# EAGLE schematic Hydra RX (EAGLE 9.0.1)
CNAME: Hydrometra 2018; CREVISION: 1.0; DESIGNER: Sergio Betancur
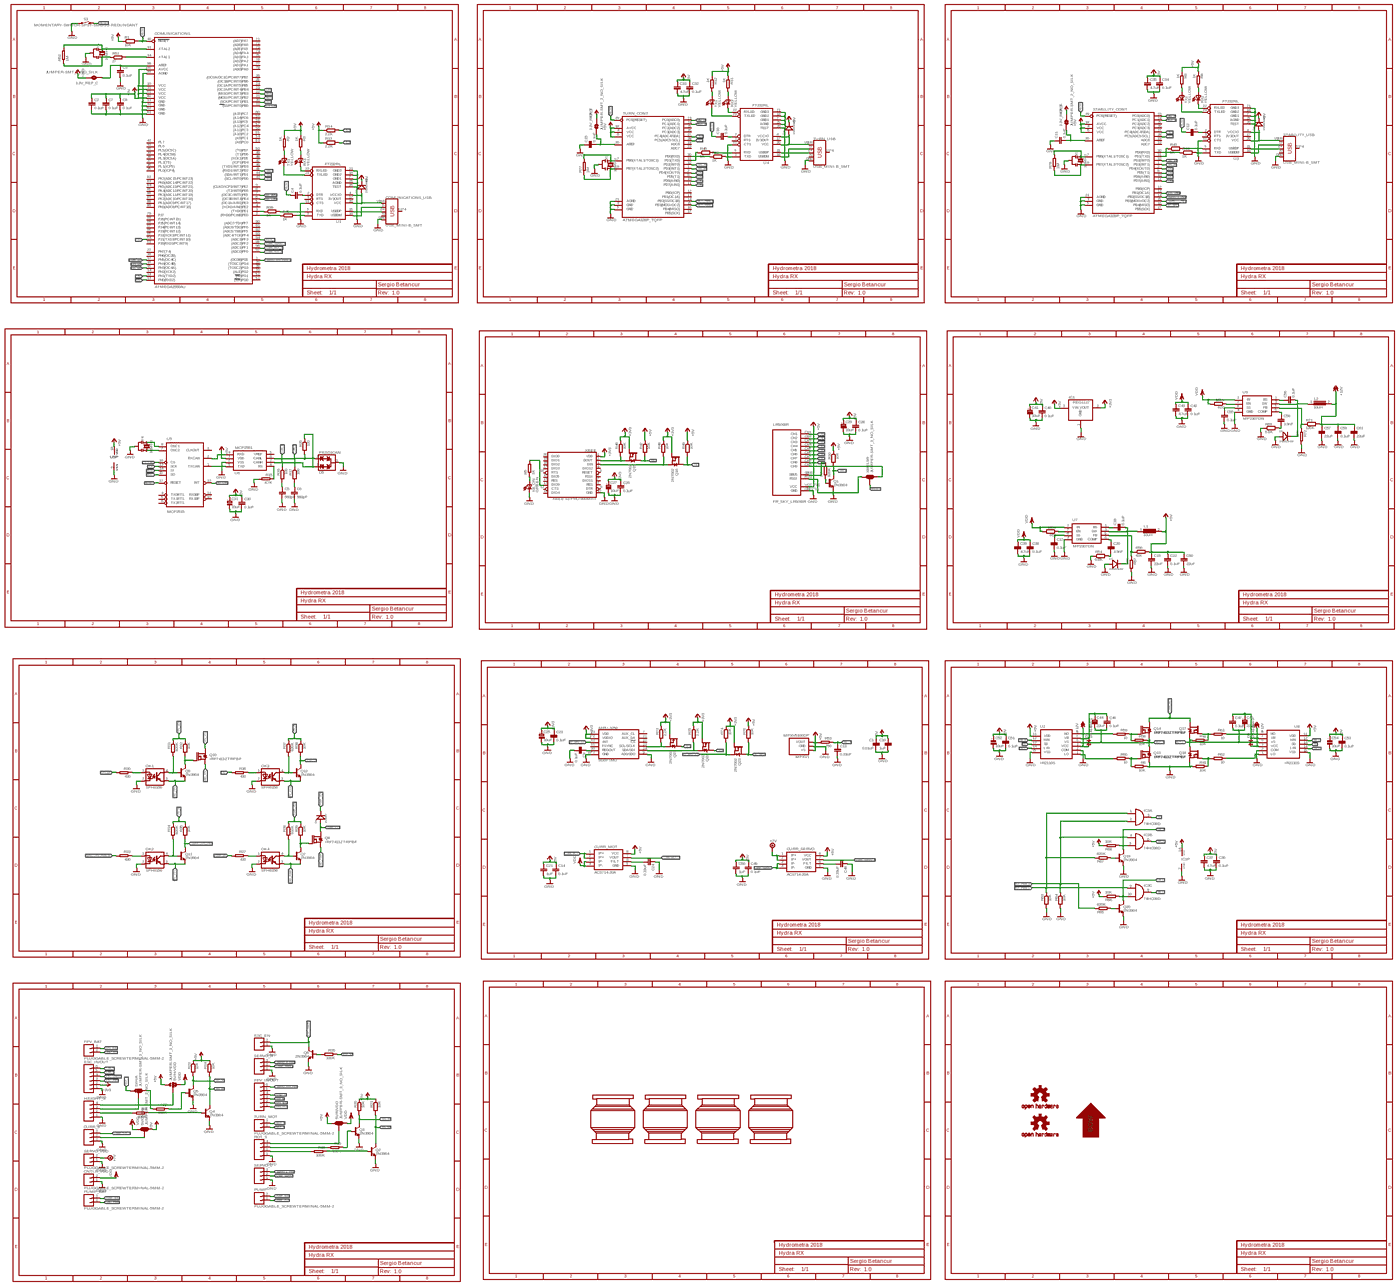
[diagram p0: schematic, sheet 1, overview]
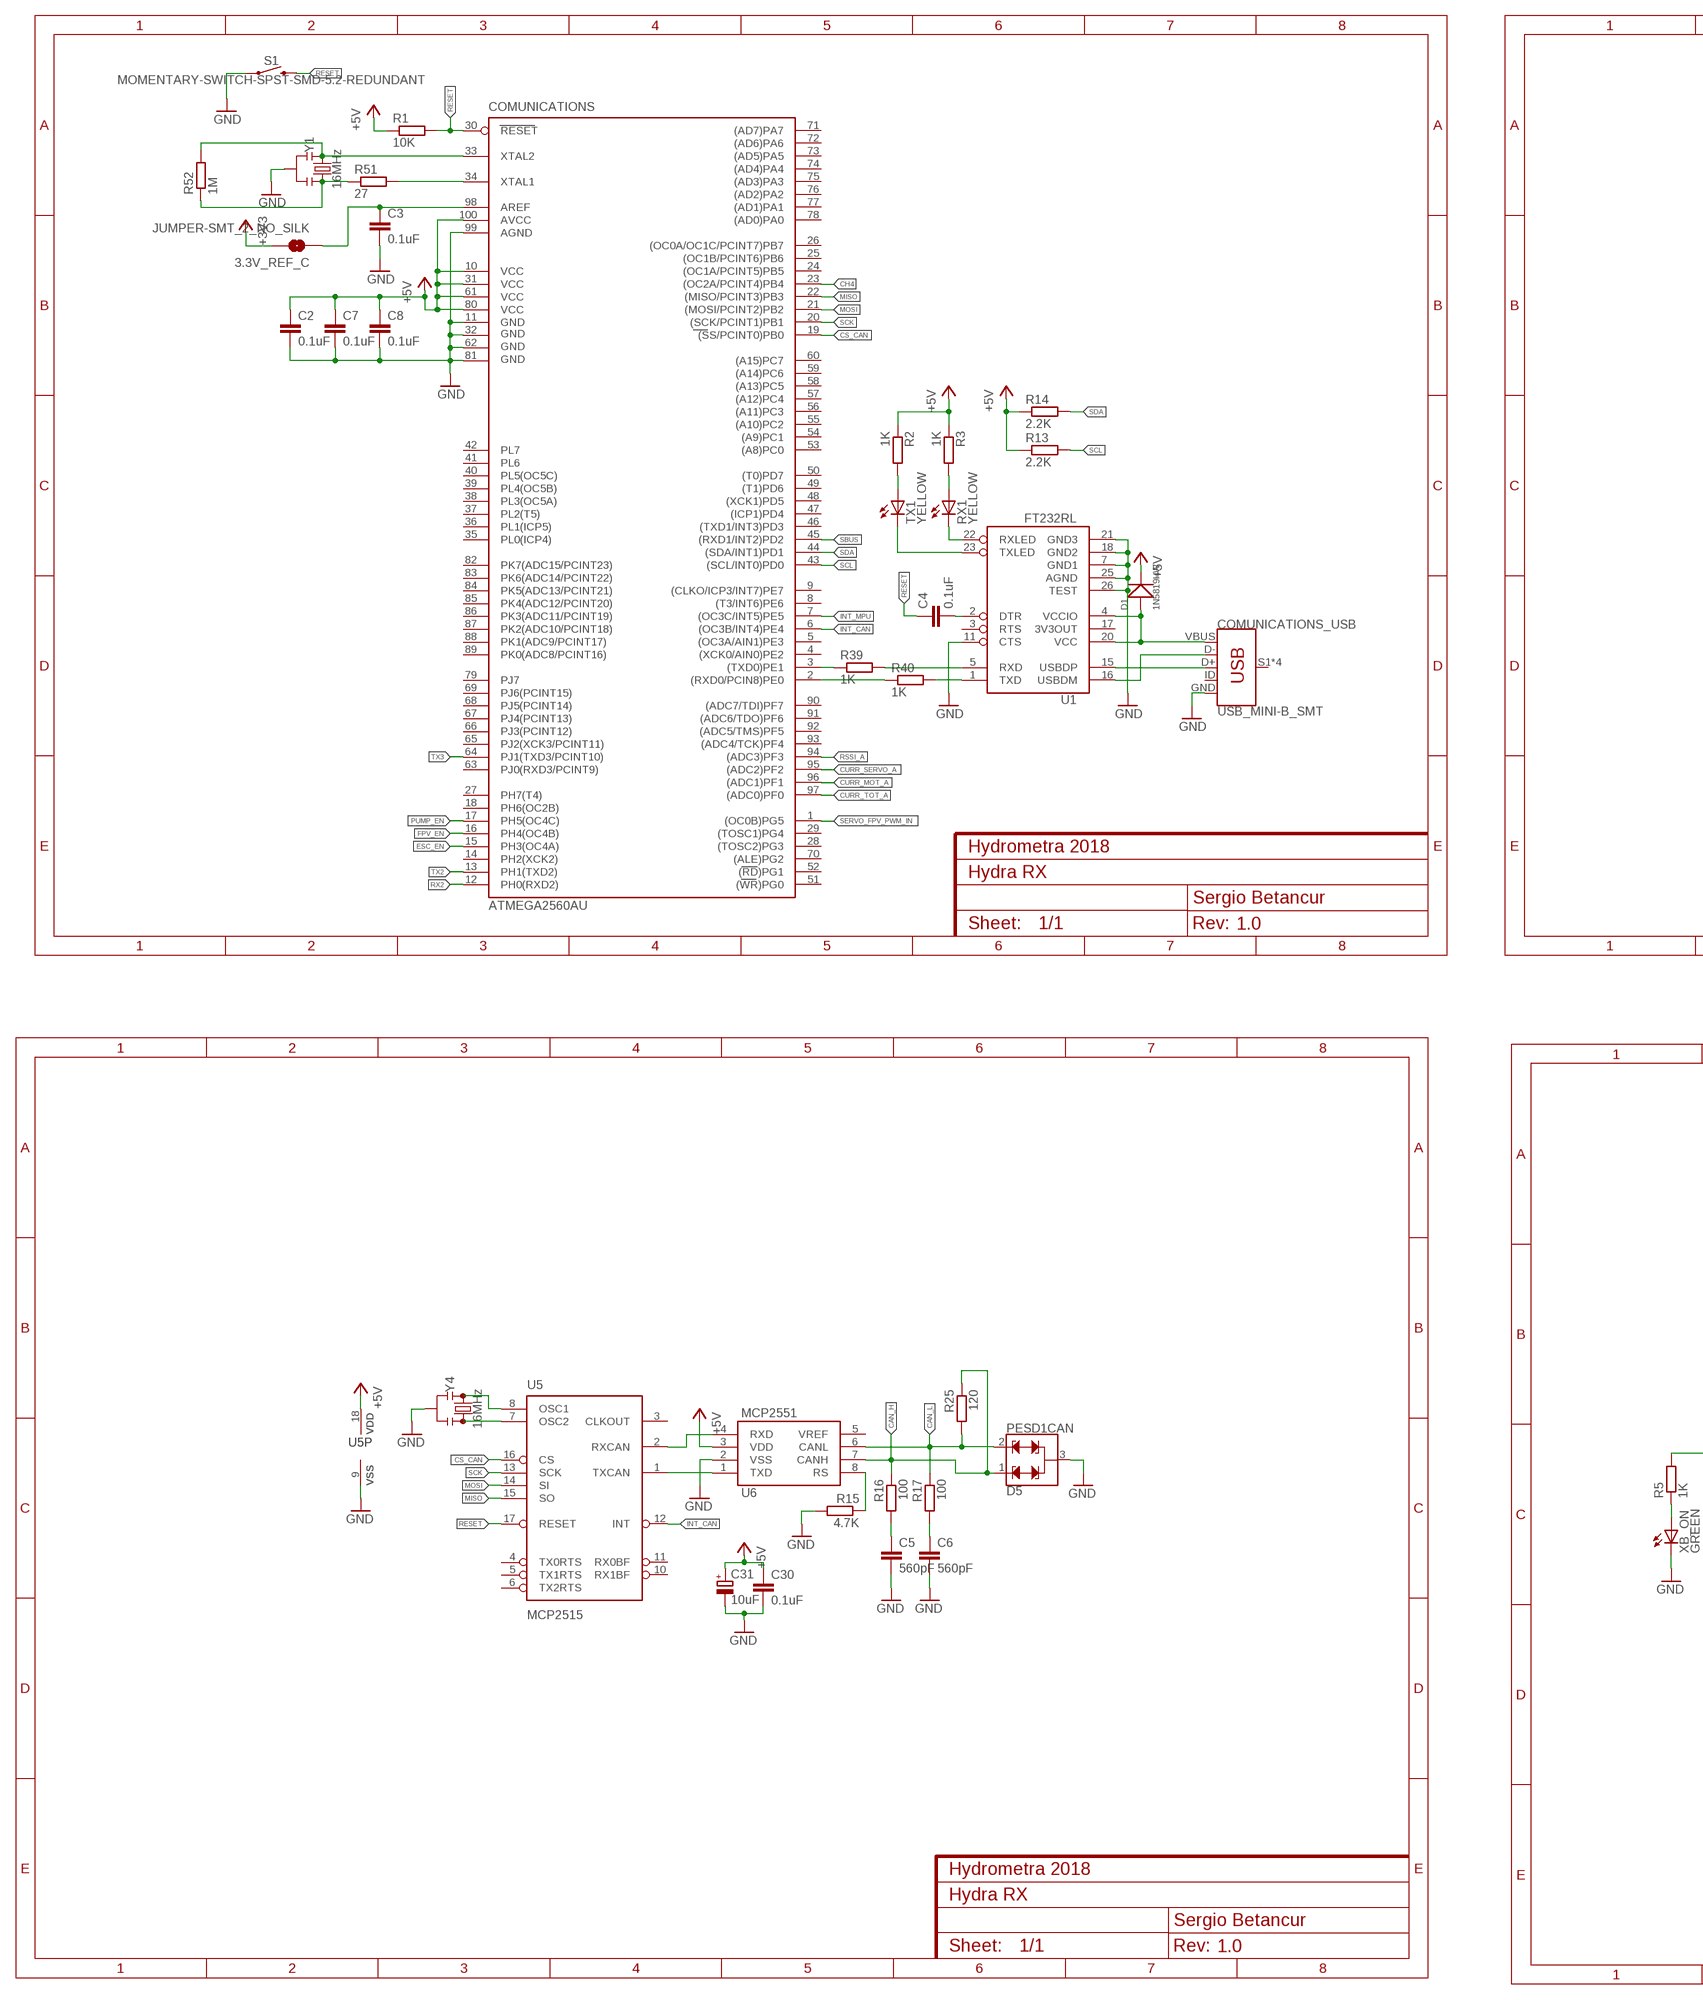
[diagram p1: schematic, sheet 1, part 1 of 4]
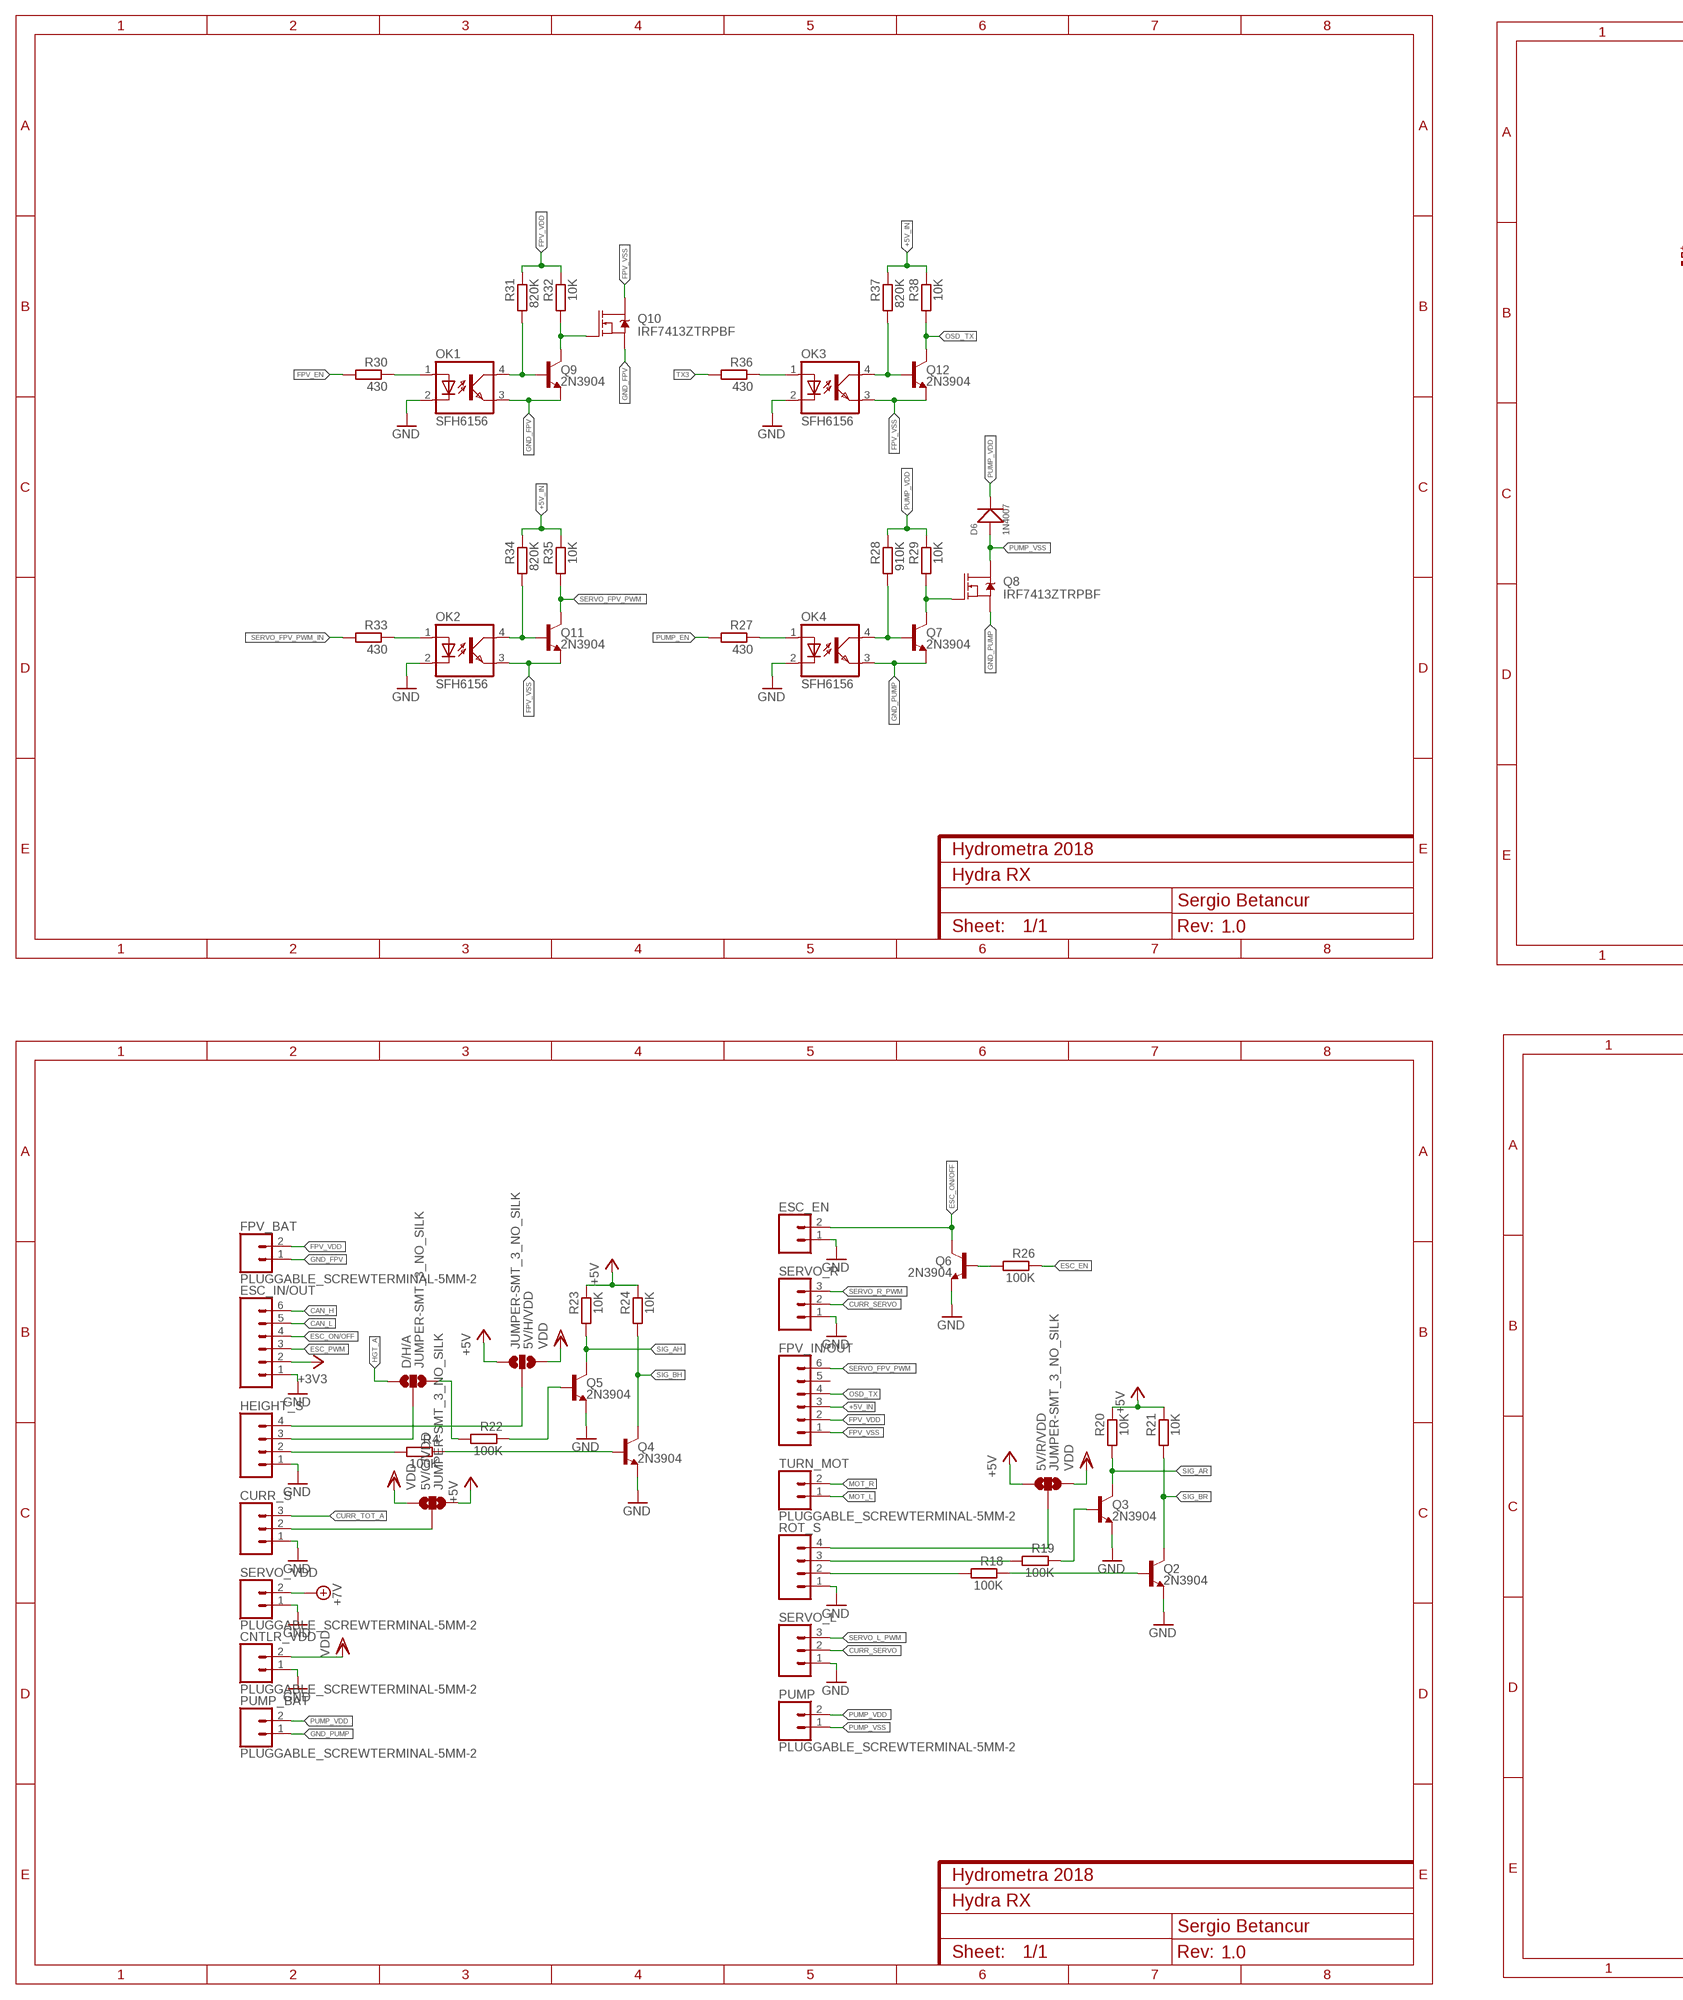
[diagram p2: schematic, sheet 1, part 2 of 4]
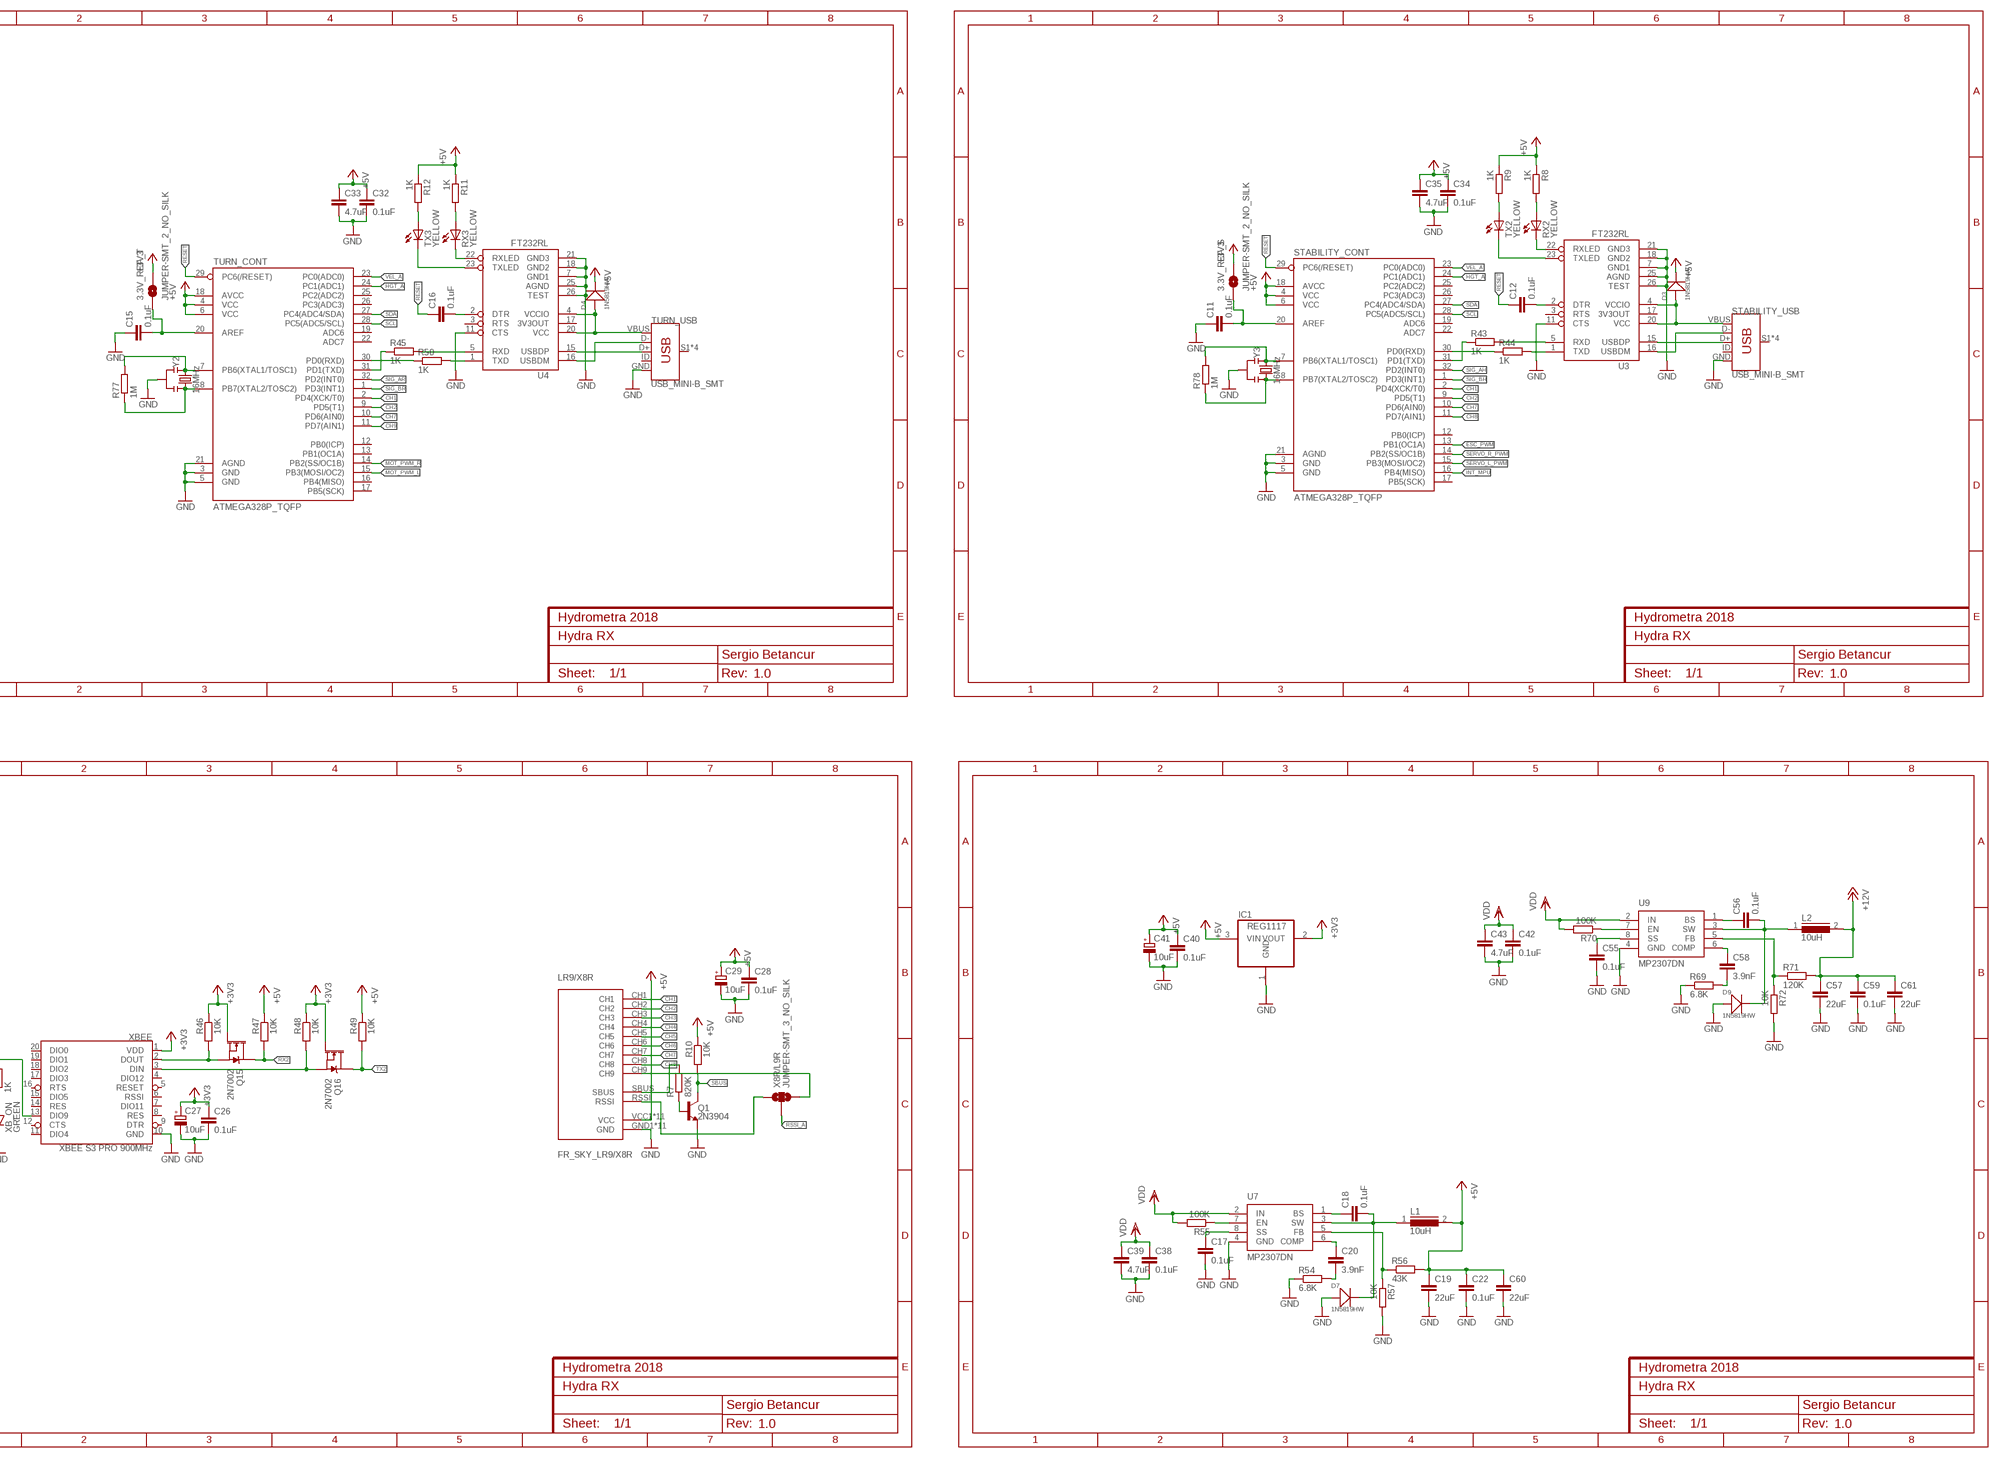
[diagram p3: schematic, sheet 1, part 3 of 4]
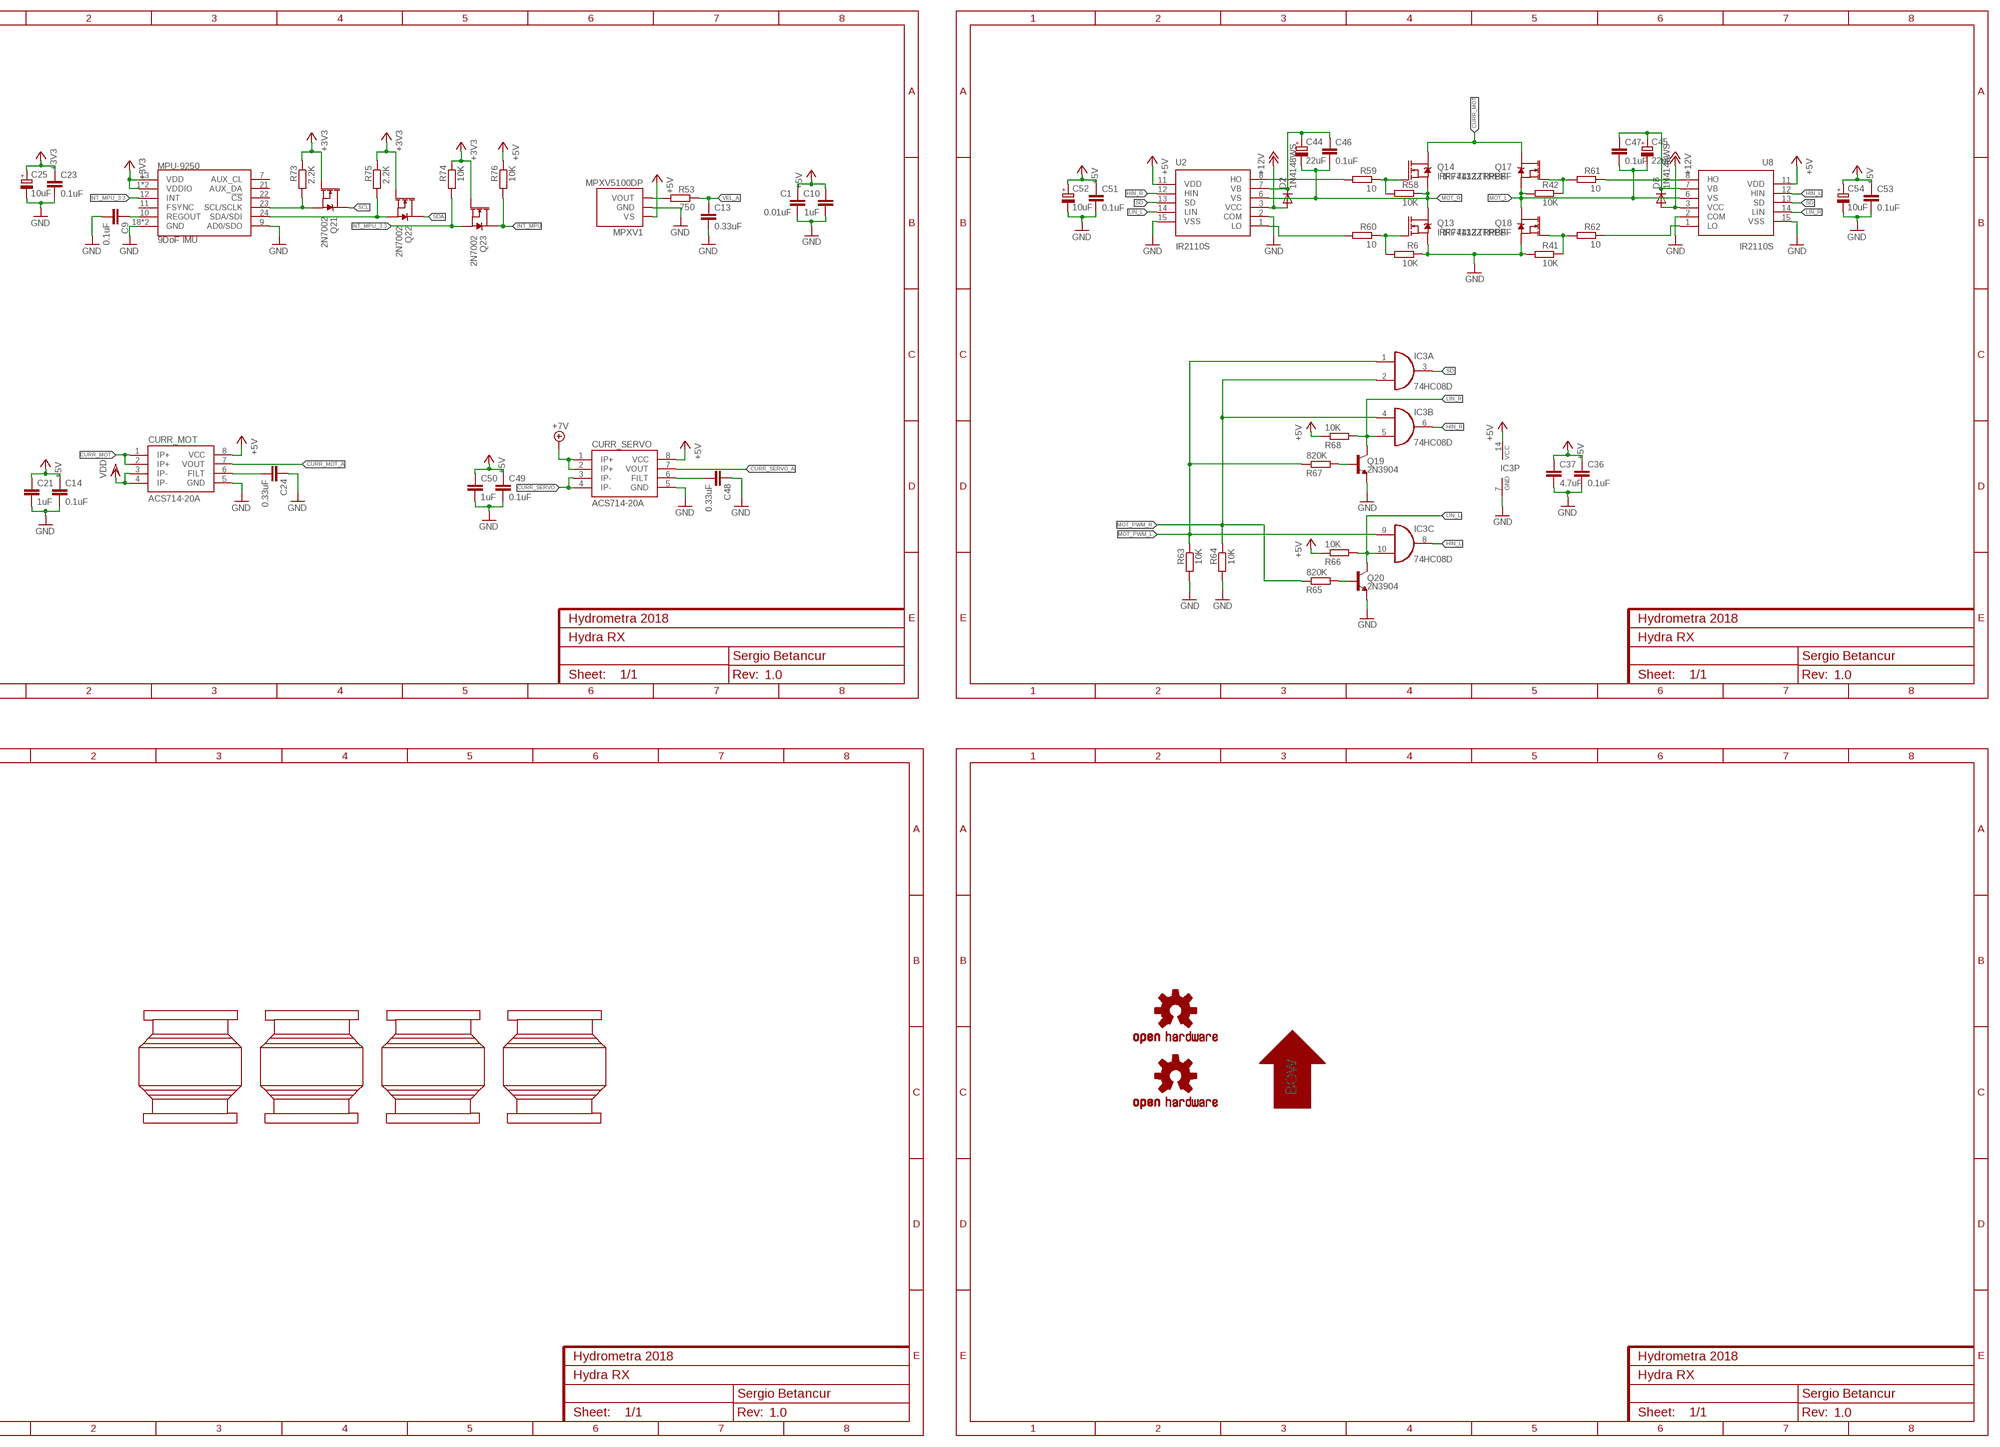
[diagram p4: schematic, sheet 1, part 4 of 4]

## Parts
3.3V_REF_C  JUMPER-SMT_2_NO_SILK  [SMT-JUMPER_2_NO_SILK]
3.3V_REF_S  JUMPER-SMT_2_NO_SILK  [SMT-JUMPER_2_NO_SILK]
3.3V_REF_T  JUMPER-SMT_2_NO_SILK  [SMT-JUMPER_2_NO_SILK]
5V/C/VDD  JUMPER-SMT_3_NO_SILK  [SMT-JUMPER_3_NO_SILK]
5V/H/VDD  JUMPER-SMT_3_NO_SILK  [SMT-JUMPER_3_NO_SILK]
5V/R/VDD  JUMPER-SMT_3_NO_SILK  [SMT-JUMPER_3_NO_SILK]
C1  0.01uF  C-EUC0603  [C0603]
C2  0.1uF  C-EUC0603  [C0603]
C3  0.1uF  C-EUC0603  [C0603]
C4  0.1uF  C-EUC0603  [C0603]
C5  560pF  C-EUC0603  [C0603]
C6  560pF  C-EUC0603  [C0603]
C7  0.1uF  C-EUC0603  [C0603]
C8  0.1uF  C-EUC0603  [C0603]
C9  0.1uF  C-EUC0603  [C0603]
C10  1uF  C-EUC0805  [C0805]
C11  0.1uF  C-EUC0603  [C0603]
C12  0.1uF  C-EUC0603  [C0603]
C13  0.33uF  C-EUC0603  [C0603]
C14  0.1uF  C-EUC0603  [C0603]
C15  0.1uF  C-EUC0603  [C0603]
C16  0.1uF  C-EUC0603  [C0603]
C17  0.1uF  C-EUC0603  [C0603]
C18  0.1uF  C-EUC0603  [C0603]
C19  22uF  C-EUC0805  [C0805]
C20  3.9nF  C-EUC0603  [C0603]
C21  1uF  C-EUC0805  [C0805]
C22  0.1uF  C-EUC0603  [C0603]
C23  0.1uF  C-EUC0603  [C0603]
C24  0.33uF  C-EUC0603  [C0603]
C25  10uF  CPOL-EUR/2012-12W  [R/2012-12W]
C26  0.1uF  C-EUC0603  [C0603]
C27  10uF  CPOL-EUR/2012-12W  [R/2012-12W]
C28  0.1uF  C-EUC0603  [C0603]
C29  10uF  CPOL-EUR/2012-12W  [R/2012-12W]
C30  0.1uF  C-EUC0603  [C0603]
C31  10uF  CPOL-EUR/2012-12W  [R/2012-12W]
C32  0.1uF  C-EUC0603  [C0603]
C33  4.7uF  C-EUC0805  [C0805]
C34  0.1uF  C-EUC0603  [C0603]
C35  4.7uF  C-EUC0805  [C0805]
C36  0.1uF  C-EUC0603  [C0603]
C37  4.7uF  C-EUC0805  [C0805]
C38  0.1uF  C-EUC0805  [C0805]
C39  4.7uF  C-EUC0805  [C0805]
C40  0.1uF  C-EUC0603  [C0603]
C41  10uF  CPOL-EUR/2012-12W  [R/2012-12W]
C42  0.1uF  C-EUC0805  [C0805]
C43  4.7uF  C-EUC0805  [C0805]
C44  22uF  CPOL-EUCT3216  [CT3216]
C45  22uF  CPOL-EUCT3216  [CT3216]
C46  0.1uF  C-EUC0805  [C0805]
C47  0.1uF  C-EUC0805  [C0805]
C48  0.33uF  C-EUC0603  [C0603]
C49  0.1uF  C-EUC0603  [C0603]
C50  1uF  C-EUC0805  [C0805]
C51  0.1uF  C-EUC0603  [C0603]
C52  10uF  CPOL-EUR/2012-12W  [R/2012-12W]
C53  0.1uF  C-EUC0603  [C0603]
C54  10uF  CPOL-EUR/2012-12W  [R/2012-12W]
C55  0.1uF  C-EUC0603  [C0603]
C56  0.1uF  C-EUC0603  [C0603]
C57  22uF  C-EUC0805  [C0805]
C58  3.9nF  C-EUC0603  [C0603]
C59  0.1uF  C-EUC0603  [C0603]
C60  22uF  C-EUC0805  [C0805]
C61  22uF  C-EUC0805  [C0805]
CNTLR_VDD  PLUGGABLE_SCREWTERMINAL-5MM-2  [PLUGGABLE_SCREWTERMINAL-5MM-2]
COMUNICATIONS  ATMEGA2560AU  [TQFP100]
COMUNICATIONS_USB  USB_MINI-B_SMT  [USB-MINIB]
CURR_MOT  ACS714-20A  ACS712  [SO08]
CURR_S  CONN_03POLAR  [MOLEX-1X3]
CURR_SERVO  ACS714-20A  ACS712  [SO08]
D1  1N5819HW  SMD-DIODE-SCHOTTKY-40V-500MA(SOD-123)  [SOD-123]
D2  1N4148WS  DIODE-SOD323-W  [SOD323-W]
D3  1N5819HW  SMD-DIODE-SCHOTTKY-40V-500MA(SOD-123)  [SOD-123]
D4  1N5819HW  SMD-DIODE-SCHOTTKY-40V-500MA(SOD-123)  [SOD-123]
D5  PESD1CAN  [SOT23-3]
D6  1N4007  DIODE-GEN-PURPOSE-1KV-1A(DO-214AC)  [DO-214AC]
D7  1N5819HW  SMD-DIODE-SCHOTTKY-40V-500MA(SOD-123)  [SOD-123]
D8  1N4148WS  DIODE-SOD323-W  [SOD323-W]
D9  1N5819HW  SMD-DIODE-SCHOTTKY-40V-500MA(SOD-123)  [SOD-123]
D/H/A  JUMPER-SMT_3_NO_SILK  [SMT-JUMPER_3_NO_SILK]
ESC_EN  CONN_02POLAR  [MOLEX-1X2]
ESC_IN/OUT  CONN_06POLAR  [MOLEX-1X6]
FIXING1  FIXING  [FIXING]
FIXING2  FIXING  [FIXING]
FIXING3  FIXING  [FIXING]
FIXING4  FIXING  [FIXING]
FPV_BAT  PLUGGABLE_SCREWTERMINAL-5MM-2  [PLUGGABLE_SCREWTERMINAL-5MM-2]
FPV_IN/OUT  CONN_06POLAR  [MOLEX-1X6]
HEIGHT_S  CONN_04POLAR  [MOLEX-1X4]
IC1  REG1117  [SOT223]
IC3  74HC08D  [SO14]
L1  10uH  DR73  [DR73]
L2  10uH  DR73  [DR73]
LOGO1  OSHW-LOGOL  [OSHW-LOGO-L]
LOGO2  OSHW-LOGOL  [OSHW-LOGO-L]
LR9/X8R  FR_SKY_LR9/X8R  FR_SKY_LR9  [FR_SKY_LR9]
MPU-9250  9DoF IMU  MPU-9250  [QFN24-3X3]
MPXV1  MPXV5100DP  [MPXV5100DP]
OK1  SFH6156  SFH6186-2  [SMD4-7]
OK2  SFH6156  SFH6186-2  [SMD4-7]
OK3  SFH6156  SFH6186-2  [SMD4-7]
OK4  SFH6156  SFH6186-2  [SMD4-7]
PUMP  PLUGGABLE_SCREWTERMINAL-5MM-2  [PLUGGABLE_SCREWTERMINAL-5MM-2]
PUMP_BAT  PLUGGABLE_SCREWTERMINAL-5MM-2  [PLUGGABLE_SCREWTERMINAL-5MM-2]
Q1  2N3904  TRANS_NPN-MMBT2222AL  [SOT23-3]
Q2  2N3904  TRANS_NPN-MMBT2222AL  [SOT23-3]
Q3  2N3904  TRANS_NPN-MMBT2222AL  [SOT23-3]
Q4  2N3904  TRANS_NPN-MMBT2222AL  [SOT23-3]
Q5  2N3904  TRANS_NPN-MMBT2222AL  [SOT23-3]
Q6  2N3904  TRANS_NPN-MMBT2222AL  [SOT23-3]
Q7  2N3904  TRANS_NPN-MMBT2222AL  [SOT23-3]
Q8  IRF7413ZTRPBF  MOSFET-NCH-FDS6630A  [SO08]
Q9  2N3904  TRANS_NPN-MMBT2222AL  [SOT23-3]
Q10  IRF7413ZTRPBF  MOSFET-NCH-FDS6630A  [SO08]
Q11  2N3904  TRANS_NPN-MMBT2222AL  [SOT23-3]
Q12  2N3904  TRANS_NPN-MMBT2222AL  [SOT23-3]
Q13  IRF7413ZTRPBF  MOSFET-NCH-FDS6630A  [SO08]
Q14  IRF7413ZTRPBF  MOSFET-NCH-FDS6630A  [SO08]
Q15  2N7002  MOSFET-NCH-AO3404A  [SOT23-3]
Q16  2N7002  MOSFET-NCH-AO3404A  [SOT23-3]
Q17  IRF7413ZTRPBF  MOSFET-NCH-FDS6630A  [SO08]
Q18  IRF7413ZTRPBF  MOSFET-NCH-FDS6630A  [SO08]
Q19  2N3904  TRANS_NPN-MMBT2222AL  [SOT23-3]
Q20  2N3904  TRANS_NPN-MMBT2222AL  [SOT23-3]
Q21  2N7002  MOSFET-NCH-AO3404A  [SOT23-3]
Q22  2N7002  MOSFET-NCH-AO3404A  [SOT23-3]
Q23  2N7002  MOSFET-NCH-AO3404A  [SOT23-3]
R1  10K  R-EU_R0603  [R0603]
R2  1K  R-EU_R0603  [R0603]
R3  1K  R-EU_R0603  [R0603]
R4  100K  R-EU_R0603  [R0603]
R5  1K  R-EU_R0603  [R0603]
R6  10K  R-EU_R0603  [R0603]
R7  820K  R-EU_R0603  [R0603]
R8  1K  R-EU_R0603  [R0603]
R9  1K  R-EU_R0603  [R0603]
R10  10K  R-EU_R0603  [R0603]
R11  1K  R-EU_R0603  [R0603]
R12  1K  R-EU_R0603  [R0603]
R13  2.2K  R-EU_R0603  [R0603]
R14  2.2K  R-EU_R0603  [R0603]
R15  4.7K  R-EU_R0603  [R0603]
R16  100  R-EU_R0603  [R0603]
R17  100  R-EU_R0603  [R0603]
R18  100K  R-EU_R0603  [R0603]
R19  100K  R-EU_R0603  [R0603]
R20  10K  R-EU_R0603  [R0603]
R21  10K  R-EU_R0603  [R0603]
R22  100K  R-EU_R0603  [R0603]
R23  10K  R-EU_R0603  [R0603]
R24  10K  R-EU_R0603  [R0603]
R25  120  R-EU_R0603  [R0603]
R26  100K  R-EU_R0603  [R0603]
R27  430  R-EU_R0603  [R0603]
R28  910K  R-EU_R0603  [R0603]
R29  10K  R-EU_R0603  [R0603]
R30  430  R-EU_R0603  [R0603]
R31  820K  R-EU_R0603  [R0603]
R32  10K  R-EU_R0603  [R0603]
R33  430  R-EU_R0603  [R0603]
R34  820K  R-EU_R0603  [R0603]
R35  10K  R-EU_R0603  [R0603]
R36  430  R-EU_R0603  [R0603]
R37  820K  R-EU_R0603  [R0603]
R38  10K  R-EU_R0603  [R0603]
R39  1K  R-EU_R0603  [R0603]
R40  1K  R-EU_R0603  [R0603]
R41  10K  R-EU_R0603  [R0603]
R42  10K  R-EU_R0603  [R0603]
R43  1K  R-EU_R0603  [R0603]
R44  1K  R-EU_R0603  [R0603]
R45  1K  R-EU_R0603  [R0603]
R46  10K  R-EU_R0603  [R0603]
R47  10K  R-EU_R0603  [R0603]
R48  10K  R-EU_R0603  [R0603]
R49  10K  R-EU_R0603  [R0603]
R50  1K  R-EU_R0603  [R0603]
R51  27  R-EU_R0603  [R0603]
R52  1M  R-EU_R0603  [R0603]
R53  750  R-EU_R0603  [R0603]
R54  6.8K  R-EU_R0603  [R0603]
R55  100K  R-EU_R0603  [R0603]
R56  43K  R-EU_R0603  [R0603]
R57  10K  R-EU_R0603  [R0603]
R58  10K  R-EU_R0603  [R0603]
R59  10  R-EU_R1206  [R1206]
R60  10  R-EU_R1206  [R1206]
R61  10  R-EU_R1206  [R1206]
R62  10  R-EU_R1206  [R1206]
R63  10K  R-EU_R0603  [R0603]
R64  10K  R-EU_R0603  [R0603]
R65  820K  R-EU_R0603  [R0603]
R66  10K  R-EU_R0603  [R0603]
R67  820K  R-EU_R0603  [R0603]
R68  10K  R-EU_R0603  [R0603]
R69  6.8K  R-EU_R0603  [R0603]
R70  100K  R-EU_R0603  [R0603]
R71  120K  R-EU_R0603  [R0603]
R72  10K  R-EU_R0603  [R0603]
R73  2.2K  R-EU_R0603  [R0603]
R74  10K  R-EU_R0603  [R0603]
R75  2.2K  R-EU_R0603  [R0603]
R76  10K  R-EU_R0603  [R0603]
R77  1M  R-EU_R0603  [R0603]
R78  1M  R-EU_R0603  [R0603]
ROT_S  CONN_04POLAR  [MOLEX-1X4]
RX1  YELLOW  LEDCHIPLED_0603  [CHIPLED_0603]
RX2  YELLOW  LEDCHIPLED_0603  [CHIPLED_0603]
RX3  YELLOW  LEDCHIPLED_0603  [CHIPLED_0603]
S1  MOMENTARY-SWITCH-SPST-SMD-5.2-REDUNDANT  [TACTILE_SWITCH_SMD_5.2MM]
SERVO_L  CONN_03POLAR  [MOLEX-1X3]
SERVO_R  CONN_03POLAR  [MOLEX-1X3]
SERVO_VDD  PLUGGABLE_SCREWTERMINAL-5MM-2  [PLUGGABLE_SCREWTERMINAL-5MM-2]
STABILITY_CONT  ATMEGA328P_TQFP  [TQFP32-08]
STABILITY_USB  USB_MINI-B_SMT  [USB-MINIB]
TURN_CONT  ATMEGA328P_TQFP  [TQFP32-08]
TURN_MOT  PLUGGABLE_SCREWTERMINAL-5MM-2  [PLUGGABLE_SCREWTERMINAL-5MM-2]
TURN_USB  USB_MINI-B_SMT  [USB-MINIB]
TX1  YELLOW  LEDCHIPLED_0603  [CHIPLED_0603]
TX2  YELLOW  LEDCHIPLED_0603  [CHIPLED_0603]
TX3  YELLOW  LEDCHIPLED_0603  [CHIPLED_0603]
U1  FT232RL  FT232RL-BASICSSOP  [SSOP28DB]
U2  IR2110S  [SO16DW]
U3  FT232RL  FT232RL-BASICSSOP  [SSOP28DB]
U4  FT232RL  FT232RL-BASICSSOP  [SSOP28DB]
U5  MCP2515  MCP2515(MCP2510)SO  [SO18W]
U6  MCP2551  [SO08]
U7  MP2307DN  [SOIC8]
U8  IR2110S  [SO16DW]
U9  MP2307DN  [SOIC8]
U$16  BOW  [BOW]
X8R/L9R  JUMPER-SMT_3_NO_SILK  [SMT-JUMPER_3_NO_SILK]
XB_ON  GREEN  LEDCHIPLED_0603  [CHIPLED_0603]
XBEE  XBEE S3 PRO 900MHz  XBEE  [XBEE]
Y1  16MHz  RESONATORSMD-3.2X1.3  [RESONATOR-SMD-3.2X1.3]
Y2  16MHz  RESONATORSMD-3.2X1.3  [RESONATOR-SMD-3.2X1.3]
Y3  16MHz  RESONATORSMD-3.2X1.3  [RESONATOR-SMD-3.2X1.3]
Y4  16MHz  RESONATORSMD-3.2X1.3  [RESONATOR-SMD-3.2X1.3]

## Nets
+3V3: 3.3V_REF_C.2 3.3V_REF_S.2 3.3V_REF_T.2 C23.1 C25.+ C26.1 C27.+ ESC_IN/OUT.2 IC1.2(VOUT) MPU-9250.1(VDDIO) MPU-9250.8(VDDIO) MPU-9250.13(VDD) Q15.1(G) Q16.1(G) Q21.1(G) Q22.1(G) Q23.1(G) R46.1 R48.1 R73.1 R74.1 R75.1 XBEE.1(VDD)
+5V: 5V/C/VDD.3 5V/H/VDD.3 5V/R/VDD.1 C1.1 C2.1 C7.1 C8.1 C10.1 C14.1 C19.1 C21.1 C22.1 C28.1 C29.+ C30.1 C31.+ C32.1 C33.1 C34.1 C35.1 C36.1 C37.1 C40.1 C41.+ C49.1 C50.1 C51.1 C52.+ C53.1 C54.+ C60.1 COMUNICATIONS.10(VCC) COMUNICATIONS.31(VCC1) COMUNICATIONS.61(VCC2) COMUNICATIONS.80(VCC3) COMUNICATIONS.100(AVCC) CURR_MOT.8(VCC) CURR_SERVO.8(VCC) D1.- D3.- D4.- IC1.3(VIN) IC3.14(P:VCC) L1.2 LR9/X8R.VCC1(VCC) LR9/X8R.VCC2(VCC) LR9/X8R.VCC3(VCC) LR9/X8R.VCC4(VCC) LR9/X8R.VCC5(VCC) LR9/X8R.VCC6(VCC) LR9/X8R.VCC7(VCC) LR9/X8R.VCC8(VCC) LR9/X8R.VCC9(VCC) LR9/X8R.VCCR(VCC) LR9/X8R.VCCS(VCC) MPXV1.2(VS) R1.1 R2.1 R3.1 R8.1 R9.1 R10.1 R11.1 R12.1 R13.1 R14.1 R20.1 R21.1 R23.1 R24.1 R47.1 R49.1 R56.2 R66.1 R68.1 R76.1 STABILITY_CONT.4(VCC) STABILITY_CONT.6(VCC) STABILITY_CONT.18(AVCC) TURN_CONT.4(VCC) TURN_CONT.6(VCC) TURN_CONT.18(AVCC) U2.11(VDD) U5.18(VDD) U6.3(VDD) U8.11(VDD)
+5V_IN: FPV_IN/OUT.3 R34.1 R35.1 R37.1 R38.1
+7V: CURR_SERVO.1(IP+) CURR_SERVO.2(IP+) SERVO_VDD.2
+12V: C57.1 C59.1 C61.1 D2.A D8.A L2.2 R71.2 U2.3(VCC) U8.3(VCC)
BS: C18.1 U7.1(BS)
BS1: C56.1 U9.1(BS)
CAN_H: D5.1 ESC_IN/OUT.6 R16.1 R25.1 U6.7(CANH)
CAN_L: D5.2 ESC_IN/OUT.5 R17.1 R25.2 U6.6(CANL)
CH1: LR9/X8R.CH1 STABILITY_CONT.2(PD4(XCK/T0)) TURN_CONT.2(PD4(XCK/T0))
CH2: LR9/X8R.CH2 STABILITY_CONT.9(PD5(T1)) TURN_CONT.9(PD5(T1))
CH3: LR9/X8R.CH3
CH4: COMUNICATIONS.23((OC2A/PCINT4)PB4) LR9/X8R.CH4
CH5: LR9/X8R.CH5
CH6: LR9/X8R.CH6
CH7: LR9/X8R.CH7 STABILITY_CONT.10(PD6(AIN0)) TURN_CONT.10(PD6(AIN0))
CH8: LR9/X8R.CH8 STABILITY_CONT.11(PD7(AIN1))
CH9: LR9/X8R.CH9 TURN_CONT.11(PD7(AIN1)) X8R/L9R.3
COMP: C20.1 U7.6(COMP)
COMP1: C58.1 U9.6(COMP)
CS_CAN: COMUNICATIONS.19((SS/PCINT0)PB0) U5.16(CS)
CURR_MOT: CURR_MOT.1(IP+) CURR_MOT.2(IP+) Q14.5(D) Q14.6(D) Q14.7(D) Q14.8(D) Q17.5(D) Q17.6(D) Q17.7(D) Q17.8(D)
CURR_MOT_A: COMUNICATIONS.96((ADC1)PF1) CURR_MOT.7(VOUT)
CURR_SERVO: CURR_SERVO.3(IP-) CURR_SERVO.4(IP-) SERVO_L.2 SERVO_R.2
CURR_SERVO_A: COMUNICATIONS.95((ADC2)PF2) CURR_SERVO.7(VOUT)
CURR_TOT_A: COMUNICATIONS.97((ADC0)PF0) CURR_S.3
DIN_XBEE: Q16.2(S) R48.2 XBEE.3(DIN)
DOUT_XBEE: Q15.2(S) R46.2 XBEE.2(DOUT)
ENCODER_VDD: 5V/R/VDD.2 ROT_S.4
ESC_EN: COMUNICATIONS.15(PH3(OC4A)) R26.1
ESC_ON/OFF: ESC_EN.2 ESC_IN/OUT.4 Q6.3(C)
ESC_PWM: ESC_IN/OUT.3 STABILITY_CONT.13(PB1(OC1A))
FB: R56.1 R57.1 U7.5(FB)
FB1: R71.1 R72.1 U9.5(FB)
FPV_EN: COMUNICATIONS.16(PH4(OC4B)) R30.2
FPV_VDD: FPV_BAT.2 FPV_IN/OUT.2 R31.1 R32.1
FPV_VSS: FPV_IN/OUT.1 OK2.3(EMIT) OK3.3(EMIT) Q10.5(D) Q10.6(D) Q10.7(D) Q10.8(D) Q11.2(E) Q12.2(E)
GND: C1.2 C2.2 C3.2 C5.2 C6.2 C7.2 C8.2 C9.2 C10.2 C11.1 C13.2 C14.2 C15.1 C17.2 C19.2 C21.2 C22.2 C23.2 C24.1 C25.- C26.2 C27.- C28.2 C29.- C30.2 C31.- C32.2 C33.2 C34.2 C35.2 C36.2 C37.2 C38.2 C39.2 C40.2 C41.- C42.2 C43.2 C48.1 C49.2 C50.2 C51.2 C52.- C53.2 C54.- C55.2 C57.2 C59.2 C60.2 C61.2 CNTLR_VDD.1 COMUNICATIONS.11(GND) COMUNICATIONS.32(GND1) COMUNICATIONS.62(GND2) COMUNICATIONS.81(GND3) COMUNICATIONS.99(AGND) COMUNICATIONS_USB.GND CURR_MOT.5(GND) CURR_S.1 CURR_SERVO.5(GND) D5.3 D7.+ D9.+ ESC_EN.1 ESC_IN/OUT.1 HEIGHT_S.1 IC1.1(GND) IC3.7(P:GND) LR9/X8R.GND1(GND) LR9/X8R.GND2(GND) LR9/X8R.GND3(GND) LR9/X8R.GND4(GND) LR9/X8R.GND5(GND) LR9/X8R.GND6(GND) LR9/X8R.GND7(GND) LR9/X8R.GND8(GND) LR9/X8R.GND9(GND) LR9/X8R.GNDR(GND) LR9/X8R.GNDS(GND) MPU-9250.9(AD0/SDO) MPU-9250.18(GND) MPU-9250.20(GND) MPXV1.3(GND) OK1.2(C) OK2.2(C) OK3.2(C) OK4.2(C) Q1.2(E) Q2.2(E) Q3.2(E) Q4.2(E) Q5.2(E) Q6.2(E) Q13.1(S) Q13.2(S) Q13.3(S) Q18.1(S) Q18.2(S) Q18.3(S) Q19.2(E) Q20.2(E) R6.1 R15.2 R41.2 R54.1 R57.2 R63.2 R64.2 R69.1 R72.2 ROT_S.1 S1.1 S1.2 SERVO_L.1 SERVO_R.1 SERVO_VDD.1 STABILITY_CONT.3(GND) STABILITY_CONT.5(GND) STABILITY_CONT.21(AGND) STABILITY_USB.GND TURN_CONT.3(GND) TURN_CONT.5(GND) TURN_CONT.21(AGND) TURN_USB.GND U1.7(GND1) U1.11(CTS) U1.18(GND2) U1.21(GND3) U1.25(AGND) U1.26(TEST) U2.2(COM) U2.15(VSS) U3.7(GND1) U3.11(CTS) U3.18(GND2) U3.21(GND3) U3.25(AGND) U3.26(TEST) U4.7(GND1) U4.11(CTS) U4.18(GND2) U4.21(GND3) U4.25(AGND) U4.26(TEST) U5.9(VSS) U6.2(VSS) U7.4(GND) U8.2(COM) U8.15(VSS) U9.4(GND) XB_ON.C XBEE.10(GND) Y1.2 Y2.2 Y3.2 Y4.2
GND_FPV: FPV_BAT.1 OK1.3(EMIT) Q9.2(E) Q10.1(S) Q10.2(S) Q10.3(S)
GND_PUMP: OK4.3(EMIT) PUMP_BAT.1 Q7.2(E) Q8.1(S) Q8.2(S) Q8.3(S)
HGT_A: D/H/A.1 STABILITY_CONT.24(PC1(ADC1)) TURN_CONT.24(PC1(ADC1))
HIN_L: IC3.8(C:O) U8.12(HIN)
HIN_R: IC3.6(B:O) U2.12(HIN)
INT_CAN: COMUNICATIONS.6((OC3B/INT4)PE4) U5.12(INT)
INT_MPU: COMUNICATIONS.7((OC3C/INT5)PE5) Q23.3(D) R76.2 STABILITY_CONT.16(PB4(MISO))
INT_MPU_3.3: MPU-9250.12(INT) Q23.2(S) R74.2
L9R: LR9/X8R.RSSI X8R/L9R.1
LIN_L: IC3.10(C:I1) Q20.3(C) R66.2 U2.14(LIN)
LIN_R: IC3.5(B:I1) Q19.3(C) R68.2 U8.14(LIN)
MISO: COMUNICATIONS.22((MISO/PCINT3)PB3) U5.15(SO)
MOSI: COMUNICATIONS.21((MOSI/PCINT2)PB2) U5.14(SI)
MOT_L: C45.- C47.2 Q17.1(S) Q17.2(S) Q17.3(S) Q18.5(D) Q18.6(D) Q18.7(D) Q18.8(D) R42.2 TURN_MOT.1 U8.6(VS)
MOT_PWM_L: IC3.1(A:I0) IC3.9(C:I0) R63.1 R67.1 TURN_CONT.15(PB3(MOSI/OC2))
MOT_PWM_R: IC3.2(A:I1) IC3.4(B:I0) R64.1 R65.1 TURN_CONT.14(PB2(SS/OC1B))
MOT_R: C44.- C46.2 Q13.5(D) Q13.6(D) Q13.7(D) Q13.8(D) Q14.1(S) Q14.2(S) Q14.3(S) R58.1 TURN_MOT.2 U2.6(VS)
N$1: R5.1 XB_ON.A
N$2: 3.3V_REF_C.1 C3.1 COMUNICATIONS.98(AREF)
N$3: COMUNICATIONS.33(XTAL2) R52.2 Y1.1
N$4: COMUNICATIONS.34(XTAL1) R51.2
N$5: COMUNICATIONS_USB.D+ U1.15(USBDP)
N$6: RX1.C U1.22(RXLED)
N$7: TX1.C U1.23(TXLED)
N$8: R5.2 XBEE.13(DIO9)
N$9: COMUNICATIONS_USB.D- U1.16(USBDM)
N$10: C5.1 R16.2
N$11: C4.2 U1.2(DTR)
N$12: R39.2 U1.5(RXD)
N$13: R40.2 U1.1(TXD)
N$14: R3.2 RX1.A
N$15: R2.2 TX1.A
N$16: 3.3V_REF_T.1 C15.2 TURN_CONT.20(AREF)
N$17: 3.3V_REF_S.1 C11.2 STABILITY_CONT.20(AREF)
N$18: COMUNICATIONS_USB.VBUS D1.+ U1.4(VCCIO) U1.20(VCC)
N$19: D4.+ TURN_USB.VBUS U4.4(VCCIO) U4.20(VCC)
N$20: Q14.4(G) R58.2 R59.1
N$21: Q13.4(G) R6.2 R60.1
N$23: R78.1 STABILITY_CONT.8(PB7(XTAL2/TOSC2)) Y3.3
N$24: Q4.1(B) R4.1
N$25: R51.1 R52.1 Y1.3
N$26: Q17.4(G) R42.1 R61.2
N$27: Q18.4(G) R41.1 R62.2
N$28: R59.2 U2.8(HO)
N$29: R60.2 U2.1(LO)
N$30: TX2.C U3.23(TXLED)
N$31: STABILITY_USB.D+ U3.15(USBDP)
N$32: STABILITY_USB.D- U3.16(USBDM)
N$33: RX2.C U3.22(RXLED)
N$34: C12.2 U3.2(DTR)
N$35: R8.2 RX2.A
N$36: R9.2 TX2.A
N$37: R44.1 STABILITY_CONT.30(PD0(RXD))
N$38: R43.1 STABILITY_CONT.31(PD1(TXD))
N$39: R77.1 TURN_CONT.8(PB7(XTAL2/TOSC2)) Y2.3
N$40: R77.2 TURN_CONT.7(PB6(XTAL1/TOSC1)) Y2.1
N$41: C6.1 R17.2
N$42: R62.1 U8.1(LO)
N$43: TX3.C U4.23(TXLED)
N$44: TURN_USB.D+ U4.15(USBDP)
N$45: TURN_USB.D- U4.16(USBDM)
N$46: RX3.C U4.22(RXLED)
N$47: C16.2 U4.2(DTR)
N$48: R11.2 RX3.A
N$49: R12.2 TX3.A
N$50: R50.1 TURN_CONT.30(PD0(RXD))
N$51: R45.1 TURN_CONT.31(PD1(TXD))
N$52: D3.+ STABILITY_USB.VBUS U3.4(VCCIO) U3.20(VCC)
N$53: 5V/C/VDD.2 CURR_S.2
N$54: R61.1 U8.8(HO)
N$56: LR9/X8R.SBUS R7.2
N$57: Q1.1(B) R7.1
N$58: U5.2(RXCAN) U6.4(RXD)
N$59: U5.1(TXCAN) U6.1(TXD)
N$60: Q5.1(B) R22.1
N$61: U5.8(OSC1) Y4.1
N$62: R15.1 U6.8(RS)
N$63: U5.7(OSC2) Y4.3
N$64: C48.2 CURR_SERVO.6(FILT)
N$65: OK4.4(COL) Q7.1(B) R28.2
N$66: C45.+ C47.1 D8.C U8.7(VB)
N$67: Q2.1(B) R18.1
N$68: Q3.1(B) R19.1
N$69: Q6.1(B) R26.2
N$70: OK4.1(A) R27.1
N$71: Q7.3(C) Q8.4(G) R29.2
N$72: OK1.4(COL) Q9.1(B) R31.2
N$73: OK1.1(A) R30.1
N$74: Q9.3(C) Q10.4(G) R32.2
N$75: OK2.4(COL) Q11.1(B) R34.2
N$76: OK2.1(A) R33.1
N$77: OK3.4(COL) Q12.1(B) R37.2
N$78: OK3.1(A) R36.1
N$79: C44.+ C46.1 D2.C U2.7(VB)
N$80: COMUNICATIONS.2((RXD0/PCIN8)PE0) R40.1
N$81: C9.1 MPU-9250.10(REGOUT)
N$82: MPXV1.4(VOUT) R53.2
N$83: C20.2 R54.2
N$84: R55.1 U7.7(EN)
N$85: Q20.1(B) R65.2
N$86: COMUNICATIONS.3((TXD0)PE1) R39.1
N$87: C24.2 CURR_MOT.6(FILT)
N$88: C58.2 R69.2
N$89: Q19.1(B) R67.2
N$90: R44.2 U3.1(TXD)
N$91: R43.2 U3.5(RXD)
N$92: R50.2 U4.1(TXD)
N$93: R45.2 U4.5(RXD)
N$94: R70.1 U9.7(EN)
N$96: R78.2 STABILITY_CONT.7(PB6(XTAL1/TOSC1)) Y3.1
OSD_TX: FPV_IN/OUT.4 Q12.3(C) R38.2
PUMP_EN: COMUNICATIONS.17(PH5(OC4C)) R27.2
PUMP_VDD: D6.2(-) PUMP.2 PUMP_BAT.2 R28.1 R29.1
PUMP_VSS: D6.1(+) PUMP.1 Q8.5(D) Q8.6(D) Q8.7(D) Q8.8(D)
RESET: C4.1 C12.1 C16.1 COMUNICATIONS.30(RESET) R1.2 S1.3 S1.4 STABILITY_CONT.29(PC6(/RESET)) TURN_CONT.29(PC6(/RESET)) U5.17(RESET)
RSSI_A: COMUNICATIONS.94((ADC3)PF3) X8R/L9R.2
RX2: COMUNICATIONS.12(PH0(RXD2)) Q15.3(D) R47.2
S_A: R19.2 ROT_S.3
S_AH: D/H/A.3 R22.2
S_B: R18.2 ROT_S.2
S_BH: HEIGHT_S.2 R4.2
SBUS: COMUNICATIONS.45((RXD1/INT2)PD2) Q1.3(C) R10.2
SCK: COMUNICATIONS.20((SCK/PCINT1)PB1) U5.13(SCK)
SCL: COMUNICATIONS.43((SCL/INT0)PD0) Q21.3(D) R13.2 STABILITY_CONT.28(PC5(ADC5/SCL)) TURN_CONT.28(PC5(ADC5/SCL))
SCL_3.3: MPU-9250.23(SCL/SCLK) Q21.2(S) R73.2
SD: IC3.3(A:O) U2.13(SD) U8.13(SD)
SDA: COMUNICATIONS.44((SDA/INT1)PD1) Q22.3(D) R14.2 STABILITY_CONT.27(PC4(ADC4/SDA)) TURN_CONT.27(PC4(ADC4/SDA))
SDA_3.3: MPU-9250.24(SDA/SDI) Q22.2(S) R75.2
SELEC_HS: D/H/A.2 HEIGHT_S.3
SENS_H_VDD: 5V/H/VDD.2 HEIGHT_S.4
SERVO_FPV_PWM: FPV_IN/OUT.6 Q11.3(C) R35.2
SERVO_FPV_PWM_IN: COMUNICATIONS.1((OC0B)PG5) R33.2
SERVO_L_PWM: SERVO_L.3 STABILITY_CONT.15(PB3(MOSI/OC2))
SERVO_R_PWM: SERVO_R.3 STABILITY_CONT.14(PB2(SS/OC1B))
SIG_AH: Q5.3(C) R23.2 STABILITY_CONT.32(PD2(INT0))
SIG_AR: Q3.3(C) R20.2 TURN_CONT.32(PD2(INT0))
SIG_BH: Q4.3(C) R24.2 STABILITY_CONT.1(PD3(INT1))
SIG_BR: Q2.3(C) R21.2 TURN_CONT.1(PD3(INT1))
SS: C17.1 U7.8(SS)
SS1: C55.1 U9.8(SS)
SW: C18.2 D7.- L1.1 U7.3(SW)
SW1: C56.2 D9.- L2.1 U9.3(SW)
TX2: COMUNICATIONS.13(PH1(TXD2)) Q16.3(D) R49.2
TX3: COMUNICATIONS.64(PJ1(TXD3/PCINT10)) R36.2
VDD: 5V/C/VDD.1 5V/H/VDD.1 5V/R/VDD.3 C38.1 C39.1 C42.1 C43.1 CNTLR_VDD.2 CURR_MOT.3(IP-) CURR_MOT.4(IP-) R55.2 R70.2 U7.2(IN) U9.2(IN)
VEL_A: C13.1 R53.1 STABILITY_CONT.23(PC0(ADC0)) TURN_CONT.23(PC0(ADC0))
Unconnected: COMUNICATIONS.4((XCK0/AIN0)PE2) COMUNICATIONS.5((OC3A/AIN1)PE3) COMUNICATIONS.8((T3/INT6)PE6) COMUNICATIONS.9((CLKO/ICP3/INT7)PE7) COMUNICATIONS.14(PH2(XCK2)) COMUNICATIONS.18(PH6(OC2B)) COMUNICATIONS.24((OC1A/PCINT5)PB5) COMUNICATIONS.25((OC1B/PCINT6)PB6) COMUNICATIONS.26((OC0A/OC1C/PCINT7)PB7) COMUNICATIONS.27(PH7(T4)) COMUNICATIONS.28((TOSC2)PG3) COMUNICATIONS.29((TOSC1)PG4) COMUNICATIONS.35(PL0(ICP4)) COMUNICATIONS.36(PL1(ICP5)) COMUNICATIONS.37(PL2(T5)) COMUNICATIONS.38(PL3(OC5A)) COMUNICATIONS.39(PL4(OC5B)) COMUNICATIONS.40(PL5(OC5C)) COMUNICATIONS.41(PL6) COMUNICATIONS.42(PL7) COMUNICATIONS.46((TXD1/INT3)PD3) COMUNICATIONS.47((ICP1)PD4) COMUNICATIONS.48((XCK1)PD5) COMUNICATIONS.49((T1)PD6) COMUNICATIONS.50((T0)PD7) COMUNICATIONS.51((WR)PG0) COMUNICATIONS.52((RD)PG1) COMUNICATIONS.53((A8)PC0) COMUNICATIONS.54((A9)PC1) COMUNICATIONS.55((A10)PC2) COMUNICATIONS.56((A11)PC3) COMUNICATIONS.57((A12)PC4) COMUNICATIONS.58((A13)PC5) COMUNICATIONS.59((A14)PC6) COMUNICATIONS.60((A15)PC7) COMUNICATIONS.63(PJ0(RXD3/PCINT9)) COMUNICATIONS.65(PJ2(XCK3/PCINT11)) COMUNICATIONS.66(PJ3(PCINT12)) COMUNICATIONS.67(PJ4(PCINT13)) COMUNICATIONS.68(PJ5(PCINT14)) COMUNICATIONS.69(PJ6(PCINT15)) COMUNICATIONS.70((ALE)PG2) COMUNICATIONS.71((AD7)PA7) COMUNICATIONS.72((AD6)PA6) COMUNICATIONS.73((AD5)PA5) COMUNICATIONS.74((AD4)PA4) COMUNICATIONS.75((AD3)PA3) COMUNICATIONS.76((AD2)PA2) COMUNICATIONS.77((AD1)PA1) COMUNICATIONS.78((AD0)PA0) COMUNICATIONS.79(PJ7) COMUNICATIONS.82(PK7(ADC15/PCINT23)) COMUNICATIONS.83(PK6(ADC14/PCINT22)) COMUNICATIONS.84(PK5(ADC13/PCINT21)) COMUNICATIONS.85(PK4(ADC12/PCINT20)) COMUNICATIONS.86(PK3(ADC11/PCINT19)) COMUNICATIONS.87(PK2(ADC10/PCINT18)) COMUNICATIONS.88(PK1(ADC9/PCINT17)) COMUNICATIONS.89(PK0(ADC8/PCINT16)) COMUNICATIONS.90((ADC7/TDI)PF7) COMUNICATIONS.91((ADC6/TDO)PF6) COMUNICATIONS.92((ADC5/TMS)PF5) COMUNICATIONS.93((ADC4/TCK)PF4) COMUNICATIONS_USB.ID COMUNICATIONS_USB.S1(SHIELD) COMUNICATIONS_USB.S2(SHIELD) COMUNICATIONS_USB.S3(SHIELD) COMUNICATIONS_USB.S4(SHIELD) FPV_IN/OUT.5 IC3.11(D:O) IC3.12(D:I0) IC3.13(D:I1) MPU-9250.7(AUX_CL) MPU-9250.11(FSYNC) MPU-9250.21(AUX_DA) MPU-9250.22(!CS) STABILITY_CONT.12(PB0(ICP)) STABILITY_CONT.17(PB5(SCK)) STABILITY_CONT.19(ADC6) STABILITY_CONT.22(ADC7) STABILITY_CONT.25(PC2(ADC2)) STABILITY_CONT.26(PC3(ADC3)) STABILITY_USB.ID STABILITY_USB.S1(SHIELD) STABILITY_USB.S2(SHIELD) STABILITY_USB.S3(SHIELD) STABILITY_USB.S4(SHIELD) TURN_CONT.12(PB0(ICP)) TURN_CONT.13(PB1(OC1A)) TURN_CONT.16(PB4(MISO)) TURN_CONT.17(PB5(SCK)) TURN_CONT.19(ADC6) TURN_CONT.22(ADC7) TURN_CONT.25(PC2(ADC2)) TURN_CONT.26(PC3(ADC3)) TURN_USB.ID TURN_USB.S1(SHIELD) TURN_USB.S2(SHIELD) TURN_USB.S3(SHIELD) TURN_USB.S4(SHIELD) U1.3(RTS) U1.17(3V3OUT) U3.3(RTS) U3.17(3V3OUT) U4.3(RTS) U4.17(3V3OUT) U5.3(CLKOUT) U5.4(TX0RTS) U5.5(TX1RTS) U5.6(TX2RTS) U5.10(RX1BF) U5.11(RX0BF) U6.5(VREF) XBEE.4(DIO12) XBEE.5(RESET) XBEE.6(RSSI) XBEE.7(DIO11) XBEE.8(RES) XBEE.9(DTR) XBEE.11(DIO4) XBEE.12(CTS) XBEE.14(RES) XBEE.15(DIO5) XBEE.16(RTS) XBEE.17(DIO3) XBEE.18(DIO2) XBEE.19(DIO1) XBEE.20(DIO0)

## Library data of the parts
3.3V_REF_C 3.3V_REF_S 3.3V_REF_T = SparkFun-Jumpers:JUMPER-SMT_2_NO: Normally open jumper This jumper has two pads in close proximity to each other. Apply solder to close the connection. Round pads are easier to solder for beginners, but are a lot larger. SparkFun Product that uses the round pads: SparkFun EL Sequencer <https://www.sparkfun.com/products/12781>
5V/C/VDD 5V/H/VDD 5V/R/VDD D/H/A X8R/L9R = SparkFun-Jumpers:JUMPER-SMT_3_NO: Normally open jumper This jumper has three pads in close proximity to each other. Apply solder to close the connection(s).
C1-C24 C26 C28 C30 C32-C40 C42 C43 C46-C51 C53 C55-C61 = rcl:C-EU: CAPACITOR, European symbol; SPICEPREFIX: C
C25 C27 C29 C31 C41 C44 C45 C52 C54 = rcl:CPOL-EU: POLARIZED CAPACITOR, European symbol; SPICEPREFIX: C
CNTLR_VDD FPV_BAT PUMP PUMP_BAT SERVO_VDD TURN_MOT = Hydra 2018:PLUGGABLE_SCREWTERMINAL-5MM-2
COMUNICATIONS = SparkFun-IC-Microcontroller:ATMEGA2560: Atmel 100-pin 8-bit uC 64/128/256 Kbytes FLASH 4 Kbytes EEPROM 8 Kbytes SRAM 86 General Purpose I/O pins 12-channels16-bit PWM 4 x Serial USARTs 16-channels 10-bit A/D SparkFun Products None.; PROD_ID: IC-10040
COMUNICATIONS_USB STABILITY_USB TURN_USB = SparkFun-Connectors:USB_MINI-B: USB type Mini-B Connector Breaks out 5th pin, and includes shield pins if needed. SparkFun Products: SparkFun FTDI Basic Breakout <https://www.sparkfun.com/products/9716> SparkFun XBee Explorer USB <https://www.sparkfun.com/products/11812> SparkFun Redboard <https://www.sparkfun.com/products/12757>; PROD_ID: CONN-08193; SF_ID: PRT-00587
CURR_MOT CURR_SERVO = SparkFun-Sensors:ACS712: ACS712 Hall-effect-based isolated linear current sensor Datasheet <http://www.sparkfun.com/datasheets/BreakoutBoards/0712.pdf> SparkFun Products SparkFun Low Current Sensor Breakout - ACS712 <https://www.sparkfun.com/products/8883> (SEN-08883); PROD_ID: IC-08964; VALUE: ACS712
CURR_S SERVO_L SERVO_R = SparkFun-Connectors:CONN_03: Multi connection point. Often used as Generic Header-pin footprint for 0.1 inch spaced/style header connections On any of the 0.1 inch spaced packages, you can populate with these: Break Away Headers - Straight <https://www.sparkfun.com/products/116> (PRT-00116) Break Away Male Headers - Right Angle <https://www.sparkfun.com/products/553> (PRT-00553) Female Headers <https://www.sparkfun.com/products/115> (PRT-00115) Break Away Headers - Machine Pin <https://www.sparkfun.com/products/117> (PRT-00117) Break Away Female Headers - Swiss Machine Pin <https://www.sparkfun.com/products/743> (PRT-00743) Stackable Header - 3 Pin (Female, 0.1") <https://www.sparkfun.com/products/13875> (PRT-13875) For SCREWTERMINALS and SPRING TERMINALS visit here: Screw Terimnals on SparkFun.com <https://www.sparkfun.com/search/results?term=Screw+Terminals> (5mm/3.5mm/2.54mm spacing) This device is also useful as a general connection point to wire up your design to another part of your project. Our various solder wires solder well into these plated through hole pads. Hook-Up Wire - Assortment (Stranded, 22 AWG) <https://www.sparkfun.com/products/11375> (PRT-11375) Hook-Up Wire - Assortment (Solid Core, 22 AWG) <https://www.sparkfun.com/products/11367> (PRT-11367) View the entire wire category on our website here <https://www.sparkfun.com/categories/141> Special notes: Molex polarized connector foot print use with SKU : PRT-08232 with associated crimp pins and housings.; PROD_ID: CONN-08625; SF_ID: PRT-08096
D1 D3 D4 D7 D9 = Seeed-Diode:SMD-DIODE-SCHOTTKY-40V-500MA(SOD-123): 304020012; MPN: B0540W; VALUE: 40V-500MA
D2 D8 = diode:DIODE-: DIODE
D5 = SparkFun-DiscreteSemi:PESD1CAN: CAN bus ESD protection diode PESD1CAN is used to protect two CAN bus lines from ESD. Link to datasheet <http://www.nxp.com/documents/data_sheet/PESD1CAN-U.pdf> SparkFun Products: SparkFun CAN-BUS Shield <https://www.sparkfun.com/products/13262>; PROD_ID: DIO-12501
D6 = Seeed-Diode:DIODE-GEN-PURPOSE-1KV-1A(DO-214AC): 304010013; MPN: 1N4007
ESC_EN = SparkFun-Connectors:CONN_02: Multi connection point. Often used as Generic Header-pin footprint for 0.1 inch spaced/style header connections On any of the 0.1 inch spaced packages, you can populate with these: Break Away Headers - Straight <https://www.sparkfun.com/products/116> (PRT-00116) Break Away Male Headers - Right Angle <https://www.sparkfun.com/products/553> (PRT-00553) Female Headers <https://www.sparkfun.com/products/115> (PRT-00115) Break Away Headers - Machine Pin <https://www.sparkfun.com/products/117> (PRT-00117) Break Away Female Headers - Swiss Machine Pin <https://www.sparkfun.com/products/743> (PRT-00743) For SCREWTERMINALS and SPRING TERMINALS visit here: Screw Terimnals on SparkFun.com <https://www.sparkfun.com/search/results?term=Screw+Terminals> (5mm/3.5mm/2.54mm spacing) This device is also useful as a general connection point to wire up your design to another part of your project. Our various solder wires solder well into these plated through hole pads. Hook-Up Wire - Assortment (Stranded, 22 AWG) <https://www.sparkfun.com/products/11375> (PRT-11375) Hook-Up Wire - Assortment (Solid Core, 22 AWG) <https://www.sparkfun.com/products/11367> (PRT-11367) View the entire wire category on our website here <https://www.sparkfun.com/categories/141> Special notes: Molex polarized connector foot print use with: PRT-08233 with associated crimp pins and housings. 2.54_SCREWTERM for use with PRT-10571. 3.5mm Screw Terminal footprints for PRT-08084 5mm Screw Terminal footprints for use with PRT-08432; SF_ID: PRT-09918
ESC_IN/OUT FPV_IN/OUT = SparkFun-Connectors:CONN_06: Multi connection point. Often used as Generic Header-pin footprint for 0.1 inch spaced/style header connections On any of the 0.1 inch spaced packages, you can populate with these: Break Away Headers - Straight <https://www.sparkfun.com/products/116> (PRT-00116) Break Away Male Headers - Right Angle <https://www.sparkfun.com/products/553> (PRT-00553) Female Headers <https://www.sparkfun.com/products/115> (PRT-00115) Break Away Headers - Machine Pin <https://www.sparkfun.com/products/117> (PRT-00117) Break Away Female Headers - Swiss Machine Pin <https://www.sparkfun.com/products/743> (PRT-00743) Arduino Stackable Header - 6 Pin <https://www.sparkfun.com/products/9280> (PRT-09280) For SCREWTERMINALS and SPRING TERMINALS visit here: Screw Terimnals on SparkFun.com <https://www.sparkfun.com/search/results?term=Screw+Terminals> (5mm/3.5mm/2.54mm spacing) This device is also useful as a general connection point to wire up your design to another part of your project. Our various solder wires solder well into these plated through hole pads. Hook-Up Wire - Assortment (Stranded, 22 AWG) <https://www.sparkfun.com/products/11375> (PRT-11375) Hook-Up Wire - Assortment (Solid Core, 22 AWG) <https://www.sparkfun.com/products/11367> (PRT-11367) View the entire wire category on our website here <https://www.sparkfun.com/categories/141>
FIXING1-FIXING4 = Hydra 2018:FIXING
HEIGHT_S ROT_S = SparkFun-Connectors:CONN_04: Multi connection point. Often used as Generic Header-pin footprint for 0.1 inch spaced/style header connections On any of the 0.1 inch spaced packages, you can populate with these: Break Away Headers - Straight <https://www.sparkfun.com/products/116> (PRT-00116) Break Away Male Headers - Right Angle <https://www.sparkfun.com/products/553> (PRT-00553) Female Headers <https://www.sparkfun.com/products/115> (PRT-00115) Break Away Headers - Machine Pin <https://www.sparkfun.com/products/117> (PRT-00117) Break Away Female Headers - Swiss Machine Pin <https://www.sparkfun.com/products/743> (PRT-00743) For SCREWTERMINALS and SPRING TERMINALS visit here: Screw Terimnals on SparkFun.com <https://www.sparkfun.com/search/results?term=Screw+Terminals> (5mm/3.5mm/2.54mm spacing) This device is also useful as a general connection point to wire up your design to another part of your project. Our various solder wires solder well into these plated through hole pads. Hook-Up Wire - Assortment (Stranded, 22 AWG) <https://www.sparkfun.com/products/11375> (PRT-11375) Hook-Up Wire - Assortment (Solid Core, 22 AWG) <https://www.sparkfun.com/products/11367> (PRT-11367) View the entire wire category on our website here <https://www.sparkfun.com/categories/141> Special notes: Molex polarized connector foot print use with SKU : PRT-08231 with associated crimp pins and housings. 1MM SMD Version SKU: PRT-10208; PROD_ID: CONN-08186; SF_ID: PRT-08231
IC1 = burr-brown:REG1117: 800mA and 1A Low Dropout (LDO) Positive Regulator 1.8V, 2.5V, 2.85V, 3.3V, 5V, and Adj; MPN: REG1117; OC_FARNELL: 1097566; OC_NEWARK: 14P6981
IC3 = 74xx-eu:74*08: Quad 2-input AND gate
L1 L2 = inductors:DR73: High Power Density, High Efficiency, Shielded Inductors Source: coiltronics_dr_series.pdf; SPICEPREFIX: L
LOGO1 LOGO2 = SparkFun-Aesthetics:OSHW-LOGO: Open-Source Hardware (OSHW) Logo This logo indicates the piece of hardware it is found on incorporates a OSHW license and/or adheres to the definition of open source hardware found here: http://freedomdefined.org/OSHW
LR9/X8R = Hydra 2018:FR_SKY_LR9
MPU-9250 = SparkFun-Sensors:MPU-9250: MPU-9250 9 Degree of Freedom IMU System in Package that contains MPU-6500 & AK8963 NC pin 19. 2-6 & 14-17 not internally connected. May be used for PCB trace routing. Datasheet <https://cdn.sparkfun.com/assets/learn_tutorials/5/5/0/MPU9250REV1.0.pdf> SparkFun Products: SparkFun 9DoF Razor IMU M0 <https://www.sparkfun.com/products/14001> SparkFun IMU Breakout - MPU-9250 <https://www.sparkfun.com/products/13762>; PROD_ID: IC-13192
MPXV1 = Hydra 2018:MPXV5100DP
OK1-OK4 = optocoupler:SFH618?*: Optocoupler, Phototransistor Output, Low Input Current Source: Data sheet <http://www.vishay.com/docs/83673/sfh618.pdf>; MF: VISHAY/TELEFUNKEN; MPN: SFH6186-2; OC_FARNELL: 1469583; OC_NEWARK: 58K2210
Q1-Q7 Q9 Q11 Q12 Q19 Q20 = SparkFun-DiscreteSemi:TRANS_NPN: NPN transistor Current controlled devices typically used to amplify current or used as a switch. BC547 - COM-08928 <http://www.sparkfun.com/products/8928> (TO-92 45V 100mA) (1.Collector 2.Base 3.Emitter) 2N3904 - COM-00521 <http://www.sparkfun.com/products/521> (TO-92 40V 200mA) (1.Emitter 2.Base 3.Collector) P2N2222A - COM-12852 <http://www.sparkfun.com/products/12852> (TO-92 40V 600mA) (1.Collector 2.Base 3.Emitter); PROD_ID: TRANS-08049; VALUE: 600mA/40V
Q8 Q10 Q13 Q14 Q17 Q18 = SparkFun-DiscreteSemi:MOSFET-NCH: N-channel MOSFETs Voltage controlled devices that allow control of high current outputs. SparkFun Products: SparkFun OpenScale <https://www.sparkfun.com/products/13261> SparkFun Digital Sandbox <https://www.sparkfun.com/products/12651> SparkFun Monster Moto Shield <https://www.sparkfun.com/products/10182> SparkFun MOSFET Power Controller <https://www.sparkfun.com/products/11214>; PROD_ID: TRANS-08089; VALUE: 6.5A/30V/38mΩ
Q15 Q16 Q21-Q23 = SparkFun-DiscreteSemi:MOSFET-NCH: N-channel MOSFETs Voltage controlled devices that allow control of high current outputs. SparkFun Products: SparkFun OpenScale <https://www.sparkfun.com/products/13261> SparkFun Digital Sandbox <https://www.sparkfun.com/products/12651> SparkFun Monster Moto Shield <https://www.sparkfun.com/products/10182> SparkFun MOSFET Power Controller <https://www.sparkfun.com/products/11214>; PROD_ID: TRANS-12988; VALUE: 5.8A/30V/35mΩ
R1-R78 = rcl:R-EU_: RESISTOR, European symbol; SPICEPREFIX: R
RX1-RX3 TX1-TX3 XB_ON = led:LED: LED OSRAM: - CHIPLED LG R971, LG N971, LY N971, LG Q971, LY Q971, LO R971, LY R971 LH N974, LH R974 LS Q976, LO Q976, LY Q976 LO Q996 - Hyper CHIPLED LW Q18S LB Q993, LB Q99A, LB R99A - SideLED LS A670, LO A670, LY A670, LG A670, LP A670 LB A673, LV A673, LT A673, LW A673 LH A674 LY A675 LS A676, LA A676, LO A676, LY A676, LW A676 LS A679, LY A679, LG A679 - Hyper Micro SIDELED® LS Y876, LA Y876, LO Y876, LY Y876 LT Y87S - SmartLED LW L88C, LW L88S LB L89C, LB L89S, LG L890 LS L89K, LO L89K, LY L89K LS L896, LA L896, LO L896, LY L896 - TOPLED LS T670, LO T670, LY T670, LG T670, LP T670 LSG T670, LSP T670, LSY T670, LOP T670, LYG T670 LG T671, LOG T671, LSG T671 LB T673, LV T673, LT T673, LW T673 LH T674 LS T676, LA T676, LO T676, LY T676, LB T676, LH T676, LSB T676, LW T676 LB T67C, LV T67C, LT T67C, LS T67K, LO T67K, LY T67K, LW E67C LS E67B, LA E67B, LO E67B, LY E67B, LB E67C, LV E67C, LT E67C LW T67C LS T679, LY T679, LG T679 LS T770, LO T770, LY T770, LG T770, LP T770 LB T773, LV T773, LT T773, LW T773 LH T774 LS E675, LA E675, LY E675, LS T675 LS T776, LA T776, LO T776, LY T776, LB T776 LHGB T686 LT T68C, LB T68C - Hyper Mini TOPLED® LB M676 - Mini TOPLED Santana® LG M470 LS M47K, LO M47K, LY M47K Source: http://www.osram.convergy.de LUXEON: - LUMILED® LXK2-PW12-R00, LXK2-PW12-S00, LXK2-PW14-U00, LXK2-PW14-V00 LXK2-PM12-R00, LXK2-PM12-S00, LXK2-PM14-U00 LXK2-PE12-Q00, LXK2-PE12-R00, LXK2-PE12-S00, LXK2-PE14-T00, LXK2-PE14-U00 LXK2-PB12-K00, LXK2-PB12-L00, LXK2-PB12-M00, LXK2-PB14-N00, LXK2-PB14-P00, LXK2-PB14-Q00 LXK2-PR12-L00, LXK2-PR12-M00, LXK2-PR14-Q00, LXK2-PR14-R00 LXK2-PD12-Q00, LXK2-PD12-R00, LXK2-PD12-S00 LXK2-PH12-R00, LXK2-PH12-S00 LXK2-PL12-P00, LXK2-PL12-Q00, LXK2-PL12-R00 Source: www.luxeon.com KINGBRIGHT: KA-3528ASYC Source: www.kingbright.com
S1 = SparkFun-Switches:MOMENTARY-SWITCH-SPST: Momentary Switch (Pushbutton) - SPST Normally-open (NO) SPST momentary switches (buttons, pushbuttons). Variants PTH-12MM - 12mm square, through-hole Momentary Pushbutton Switch - 12mm Square <https://www.sparkfun.com/products/9190> (COM-09190) PTH-6.0MM, PTH-6.0MM-KIT - 6.0mm square, through-hole Mini Pushbutton Switch <https://www.sparkfun.com/products/97> (COM-00097) KIT package intended for soldering kit's - only one side of pads' copper is exposed. PTH-RIGHT-ANGLE-KIT - Right-angle, through-hole Right Angle Tactile Button <https://www.sparkfun.com/products/10791> - Used on SparkFun BigTime Watch Kit <https://www.sparkfun.com/products/11734> SMD-12MM - 12mm square, surface-mount Tactile Button - SMD (12mm) <https://www.sparkfun.com/products/12993> (COM-12993) Used on SparkFun PicoBoard <https://www.sparkfun.com/products/11888> SMD-4.5MM - 4.5mm Square Trackball Switch Used on SparkFun Blackberry Trackballer Breakout <https://www.sparkfun.com/products/13169> SMD-4.6MMX2.8MM - 4.60mm x 2.80mm, surface mount Used on SparkFun SAMD21 Mini Breakout <https://www.sparkfun.com/products/13664> SMD-5.2MM, SMD-5.2-REDUNDANT - 5.2mm square, surface-mount Mini Pushbutton Switch - SMD <https://www.sparkfun.com/products/8720> (COM-08720) Used on Arduino Pro Mini <https://www.sparkfun.com/products/11114> REDUNDANT package connects both switch circuits together SMD-6.0X3.5MM - 6.0 x 3.5mm, surface mount Momentary Reset Switch SMD <https://www.sparkfun.com/products/8229> (COM-08229) SMD-6.2MM-TALL - 6.2mm square, surface mount Tactile Button - SMD (6mm) <https://www.sparkfun.com/products/12992> Used on SparkFun Digital Sandbox <https://www.sparkfun.com/products/12651> SMD-RIGHT-ANGLE - Right-angle, surface mount Used on SparkFun Block for Intel® Edison - Arduino <https://www.sparkfun.com/products/13036>; PROD_ID: SWCH-08247; SF_SKU: COM-08720
STABILITY_CONT TURN_CONT = SparkFun-IC-Microcontroller:ATMEGA328P_TQFP: Popular 328P in QFP Storefront component: ATmega328 - TQFP <https://www.sparkfun.com/products/13448> (COM-13448) Datasheet <http://www.sparkfun.com/datasheets/Components/SMD/ATMega328.pdf> SparkFun Products SparkFun RedBoard - Programmed with Arduino <https://www.sparkfun.com/products/12757> (DEV-12757) Arduino Pro Mini 328 - 5V/16MHz <https://www.sparkfun.com/products/11113> (DEV-11113) Arduino Pro Mini 328 - 3.3V/8MHz <https://www.sparkfun.com/products/11114> (DEV-11114) SparkFun OpenLog <https://www.sparkfun.com/products/13712> (DEV-13712) SparkFun MicroView - OLED Arduino Module <https://www.sparkfun.com/products/12923> (DEV-12923) SparkFun Digital Sandbox <https://www.sparkfun.com/products/12651> (DEV-12651) SparkFun PicoBoard <https://www.sparkfun.com/products/11888> (WIG-11888) Arduino Fio <https://www.sparkfun.com/products/10116> (DEV-10116) LilyPad Arduino 328 Main Board <https://www.sparkfun.com/products/13342> (DEV-13342) SparkFun RedStick <https://www.sparkfun.com/products/13741> (DEV-13741) LilyPad MP3 <https://www.sparkfun.com/products/11013> (DEV-11013) LilyPad Arduino SimpleSnap <https://www.sparkfun.com/products/10941> (DEV-10941) SparkFun Stepoko <https://www.sparkfun.com/products/13899> (ROB-13899) SparkFun Geiger Counter <https://www.sparkfun.com/products/11345> (SEN-11345) SparkFun EL Sequencer <https://www.sparkfun.com/products/12781> (COM-12781) Arduino Pro 328 - 5V/16MHz <https://www.sparkfun.com/products/10915> (DEV-10915) CryptoCape <https://www.sparkfun.com/products/12773> (DEV-12773) SparkFun IR Thermometer Evaluation Board - MLX90614 <https://www.sparkfun.com/products/10740> (SEN-10740) SparkFun RedBot Mainboard <https://www.sparkfun.com/products/12097> (ROB-12097) Arduino Pro 328 - 3.3V/8MHz <https://www.sparkfun.com/products/10914> (DEV-10914) SparkFun Block for Intel® Edison - Arduino <https://www.sparkfun.com/products/13036> (DEV-13036) SparkFun Simon Says - Surface Mount Soldering Kit <https://www.sparkfun.com/products/10935> (KIT-10935) SparkFun 7-Segment Serial Display - Red <https://www.sparkfun.com/products/11441> (COM-11441) SparkFun 7-Segment Serial Display - White <https://www.sparkfun.com/products/11629> (COM-11629) SparkFun 7-Segment Serial Display - Yellow <https://www.sparkfun.com/products/11443> (COM-11443) SparkFun 7-Segment Serial Display - Kelly Green <https://www.sparkfun.com/products/11440> (COM-11440) SparkFun 7-Segment Serial Display - Blue <https://www.sparkfun.com/products/11442> (COM-11442) SparkFun OpenSegment Serial Display - 20mm (Blue) <https://www.sparkfun.com/products/11647> (COM-11647) SparkFun OpenSegment Serial Display - 20mm (Green) <https://www.sparkfun.com/products/11646> (COM-11646) SparkFun OpenSegment Serial Display - 20mm (White) <https://www.sparkfun.com/products/11648> (COM-11648) SparkFun OpenSegment Serial Display - 20mm (Red) <https://www.sparkfun.com/products/11644> (COM-11644) SparkFun OpenSegment Serial Display - 20mm (Yellow) <https://www.sparkfun.com/products/11645> (COM-11645) SparkFun OpenSegment Shield <https://www.sparkfun.com/products/13190> (DEV-13190); PROD_ID: IC-09069
U1 U3 U4 = SparkFun-IC-Comms:FT232RL-BASIC: FT232RL USB UART This is the simplified version of the FT232RL unit. Only what you need, nothing you don't. FT232RL 4th Generation USB UART (USB <-> Serial) Controller. Datasheet <http://www.sparkfun.com/datasheets/IC/FT232R_v104.pdf> SparkFun Products Component <https://www.sparkfun.com/products/650> (COM-00650) SparkFun RedBot Mainboard <https://www.sparkfun.com/products/12097> (ROB-12097) SparkFun FTDI Basic Breakout - 5V <https://www.sparkfun.com/products/9716> (DEV-09716) SparkFun FTDI Basic Breakout - 3.3V <https://www.sparkfun.com/products/9873> (DEV-09873) Bus Pirate - v3.6a <https://www.sparkfun.com/products/12942> (TOL-12942) SparkFun USB to Serial Breakout - FT232RL <https://www.sparkfun.com/products/12731> (BOB-12731) SparkFun PicoBoard <https://www.sparkfun.com/products/11888> (WIG-11888) SparkFun RFID USB Reader <https://www.sparkfun.com/products/9963> (SEN-09963) LilyPad FTDI Basic Breakout - 5V <https://www.sparkfun.com/products/10275> (DEV-10275) SparkFun Stepoko <https://www.sparkfun.com/products/13899> (ROB-13899); PROD_ID: IC-00870
U2 U8 = Hydra 2018:IR2110S
U5 = SparkFun-IC-Comms:MCP2515(MCP2510): CAN controller with SPI interface The MCP2515 controller supercedes the MCP2510 while addressing all errata associated with it. The two devices are pin compatible, either can be used with this device. 18-pin package SOIC Simple SPI interface to any MCU. One-shot mode ensures message transmission is attempted only once Databyte filtering Start-of-Frame (SOF) output Low-power CMOS Technology Datasheet <http://www.sparkfun.com/datasheets/DevTools/Arduino/MCP2515.pdf> SparkFun Products CAN-BUS Shield <https://www.sparkfun.com/products/13262> (DEV-13262); PROD_ID: IC-09906
U6 = SparkFun-IC-Comms:MCP2551: MCP2551 High Speed CAN Transceiver High speed CAN transceiver Datasheet <http://www.sparkfun.com/datasheets/DevTools/Arduino/MCP2551.pdf> SparkFun Products CAN-BUS Shield <https://www.sparkfun.com/products/13262> (DEV-13262) SparkFun OBD-II UART <https://www.sparkfun.com/products/9555> (WIG-09555); PROD_ID: IC-09907
U7 U9 = All-IN:MP2307DN
U$16 = Hydra 2018:BOW
XBEE = SparkFun-RF:XBEE: Digi XBee and XBee Pro XBees are tiny blue chips that can communicate wirelessly with each other. They can do simple things, like replacing a couple of wires in serial communication, which is nice when you want to make a remote for your paintball vehicle. SparkFun Products SparkFun XBee Buying Guide <https://www.sparkfun.com/pages/xbee_guide> SparkFun XBee Explorer USB <https://www.sparkfun.com/products/11812> (WRL-11812) Breakout Board for XBee Module <https://www.sparkfun.com/products/8276> (WRL-8276) SparkFun XBee Explorer Regulated <https://www.sparkfun.com/products/11373> (WRL-11373) SparkFun XBee Explorer Dongle <https://www.sparkfun.com/products/11697> (WRL-11697) SparkFun XBee Shield <https://www.sparkfun.com/products/12847> (WRL-12847) SparkFun XBee Explorer Serial <https://www.sparkfun.com/products/13225> (WRL-13225)
Y1-Y4 = SparkFun-Clocks:RESONATOR: Resonators (Generic) Ceramic resonators are clock-generating components, often used to control timing in microcontrollers. They usually have 3 pins: two pins for oscillation, and one pin for ground. Compared to crystals, resonators have worse tolerance, but are usually much cheaper. Plus, they have built-in load capacitors! These devices are used on boards like the Arduino Pro 8MHz <https://www.sparkfun.com/products/11114> and Arduino Pro 16MHz <https://www.sparkfun.com/products/11113>.